# EAGLE schematic ELOB_V1722_Index_B (EAGLE 6.5.0)

## Sheet 1 of 8: Controller
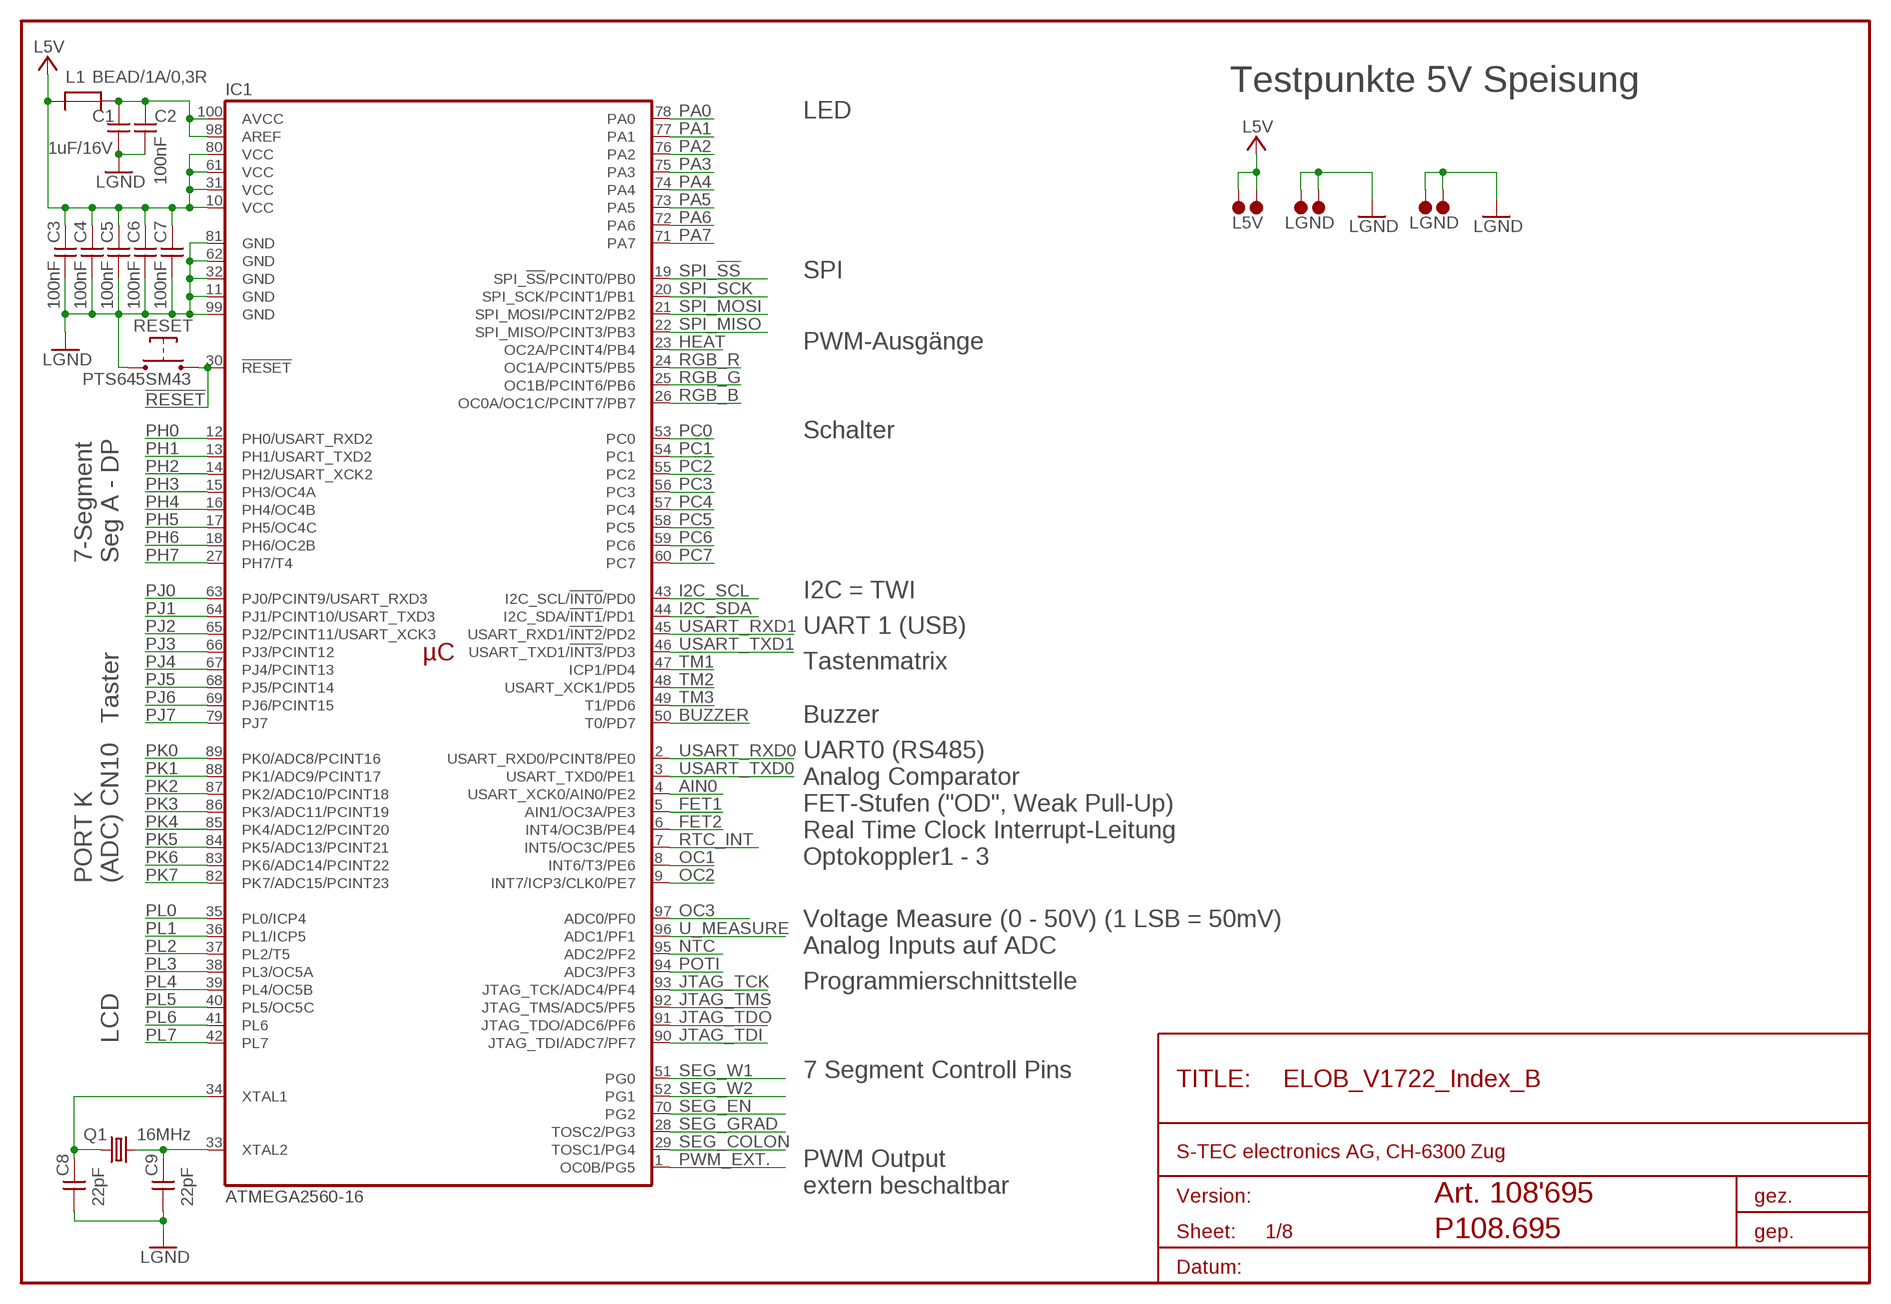
[diagram p0: schematic, sheet 1]

### Parts
.L5V  L5V  TESTPAD_2P_V1_NORESTRICT  [TESTPAD_2P_V1_NORESTRICT]
C1  1uF/16V  C_SMD0603  [C0603]
C2  100nF  C_SMD0603  [C0603]
C3  100nF  C_SMD0603  [C0603]
C4  100nF  C_SMD0603  [C0603]
C5  100nF  C_SMD0603  [C0603]
C6  100nF  C_SMD0603  [C0603]
C7  100nF  C_SMD0603  [C0603]
C8  22pF  C_SMD0603  [C0603]
C9  22pF  C_SMD0603  [C0603]
IC1  ATMEGA2560-16  ATMEGA2560_TQFP100  [TQFP100]
L1  BEAD/1A/0,3R  FERRITE-BEAD_1206  [R1206]
Q1  16MHz  CRYSTALA  [HC49_S]
RESET  PTS645SM43  TASTER_C&K_PTS645_SMD  [DTSM-6]
TP1  LGND  TESTPAD_2P_V1_NORESTRICT  [TESTPAD_2P_V1_NORESTRICT]
TP12  LGND  TESTPAD_2P_V1_NORESTRICT  [TESTPAD_2P_V1_NORESTRICT]

### Nets
!RESET!: IC1.30(!RESET!) RESET.3 RESET.4 ; also sheet 5
AIN0: IC1.4(USART_XCK0/AIN0/PE2) ; also sheet 5
BUZZER: IC1.50(T0/PD7) ; also sheet 6
FET1: IC1.5(AIN1/OC3A/PE3) ; also sheet 4
FET2: IC1.6(INT4/OC3B/PE4) ; also sheet 4
HEAT: IC1.23(OC2A/PCINT4/PB4) ; also sheet 6
I2C_SCL: IC1.43(I2C_SCL/!INT0!/PD0) ; also sheet 5,7
I2C_SDA: IC1.44(I2C_SDA/!INT1!/PD1) ; also sheet 5,7
JTAG_TCK: IC1.93(JTAG_TCK/ADC4/PF4) ; also sheet 5
JTAG_TDI: IC1.90(JTAG_TDI/ADC7/PF7) ; also sheet 5
JTAG_TDO: IC1.91(JTAG_TDO/ADC6/PF6) ; also sheet 5
JTAG_TMS: IC1.92(JTAG_TMS/ADC5/PF5) ; also sheet 5
L5V: .L5V.1 .L5V.2 C3.1 C4.1 C5.1 C6.1 C7.1 IC1.10(VCC) IC1.31(VCC) IC1.61(VCC) IC1.80(VCC) L1.1 ; supply symbol labelled .L5V ; also sheet 2,3,4,5,6,7,8
LGND: C1.2 C2.2 C3.2 C4.2 C5.2 C6.2 C7.2 C8.2 C9.2 IC1.11(GND) IC1.32(GND) IC1.62(GND) IC1.81(GND) IC1.99(GND) RESET.1 RESET.2 TP1.1 TP1.2 TP12.1 TP12.2 ; supply symbol labelled .LGND ; also sheet 2,3,4,5,6,7,8
N$2: C8.1 IC1.34(XTAL1) Q1.1
N$6: C9.1 IC1.33(XTAL2) Q1.2
N$9: C1.1 C2.1 IC1.98(AREF) IC1.100(AVCC) L1.2
NTC: IC1.95(ADC2/PF2) ; also sheet 6
OC1: IC1.8(INT6/T3/PE6) ; also sheet 4
OC2: IC1.9(INT7/ICP3/CLK0/PE7) ; also sheet 4
OC3: IC1.97(ADC0/PF0) ; also sheet 4
PA0: IC1.78(PA0) ; also sheet 2
PA1: IC1.77(PA1) ; also sheet 2
PA2: IC1.76(PA2) ; also sheet 2
PA3: IC1.75(PA3) ; also sheet 2
PA4: IC1.74(PA4) ; also sheet 2
PA5: IC1.73(PA5) ; also sheet 2
PA6: IC1.72(PA6) ; also sheet 2
PA7: IC1.71(PA7) ; also sheet 2
PC0: IC1.53(PC0) ; also sheet 2
PC1: IC1.54(PC1) ; also sheet 2
PC2: IC1.55(PC2) ; also sheet 2
PC3: IC1.56(PC3) ; also sheet 2
PC4: IC1.57(PC4) ; also sheet 2
PC5: IC1.58(PC5) ; also sheet 2
PC6: IC1.59(PC6) ; also sheet 2
PC7: IC1.60(PC7) ; also sheet 2
PH0: IC1.12(PH0/USART_RXD2) ; also sheet 3,5
PH1: IC1.13(PH1/USART_TXD2) ; also sheet 3,5
PH2: IC1.14(PH2/USART_XCK2) ; also sheet 3,5
PH3: IC1.15(PH3/OC4A) ; also sheet 3,5
PH4: IC1.16(PH4/OC4B) ; also sheet 3,5
PH5: IC1.17(PH5/OC4C) ; also sheet 3,5
PH6: IC1.18(PH6/OC2B) ; also sheet 3,5
PH7: IC1.27(PH7/T4) ; also sheet 3,5
PJ0: IC1.63(PJ0/PCINT9/USART_RXD3) ; also sheet 2
PJ1: IC1.64(PJ1/PCINT10/USART_TXD3) ; also sheet 2
PJ2: IC1.65(PJ2/PCINT11/USART_XCK3) ; also sheet 2
PJ3: IC1.66(PJ3/PCINT12) ; also sheet 2
PJ4: IC1.67(PJ4/PCINT13) ; also sheet 2
PJ5: IC1.68(PJ5/PCINT14) ; also sheet 2
PJ6: IC1.69(PJ6/PCINT15) ; also sheet 2
PJ7: IC1.79(PJ7) ; also sheet 2
PK0: IC1.89(PK0/ADC8/PCINT16) ; also sheet 5
PK1: IC1.88(PK1/ADC9/PCINT17) ; also sheet 5
PK2: IC1.87(PK2/ADC10/PCINT18) ; also sheet 5
PK3: IC1.86(PK3/ADC11/PCINT19) ; also sheet 5
PK4: IC1.85(PK4/ADC12/PCINT20) ; also sheet 5
PK5: IC1.84(PK5/ADC13/PCINT21) ; also sheet 5
PK6: IC1.83(PK6/ADC14/PCINT22) ; also sheet 5
PK7: IC1.82(PK7/ADC15/PCINT23) ; also sheet 5
PL0: IC1.35(PL0/ICP4) ; also sheet 7
PL1: IC1.36(PL1/ICP5) ; also sheet 7
PL2: IC1.37(PL2/T5) ; also sheet 7
PL3: IC1.38(PL3/OC5A) ; also sheet 7
PL4: IC1.39(PL4/OC5B) ; also sheet 7
PL5: IC1.40(PL5/OC5C) ; also sheet 7
PL6: IC1.41(PL6) ; also sheet 7
PL7: IC1.42(PL7) ; also sheet 7
POTI: IC1.94(ADC3/PF3) ; also sheet 6
PWM_EXT.: IC1.1(OC0B/PG5) ; also sheet 5
RGB_B: IC1.26(OC0A/OC1C/PCINT7/PB7) ; also sheet 6
RGB_G: IC1.25(OC1B/PCINT6/PB6) ; also sheet 6
RGB_R: IC1.24(OC1A/PCINT5/PB5) ; also sheet 6
RTC_INT: IC1.7(INT5/OC3C/PE5) ; also sheet 7
SEG_COLON: IC1.29(TOSC1/PG4) ; also sheet 3
SEG_EN: IC1.70(PG2) ; also sheet 3
SEG_GRAD: IC1.28(TOSC2/PG3) ; also sheet 3
SEG_W1: IC1.51(PG0) ; also sheet 3
SEG_W2: IC1.52(PG1) ; also sheet 3
SPI_!SS!: IC1.19(SPI_!SS!/PCINT0/PB0) ; also sheet 5
SPI_MISO: IC1.22(SPI_MISO/PCINT3/PB3) ; also sheet 5
SPI_MOSI: IC1.21(SPI_MOSI/PCINT2/PB2) ; also sheet 5
SPI_SCK: IC1.20(SPI_SCK/PCINT1/PB1) ; also sheet 5
TM1: IC1.47(ICP1/PD4) ; also sheet 3
TM2: IC1.48(USART_XCK1/PD5) ; also sheet 3
TM3: IC1.49(T1/PD6) ; also sheet 3
U_MEASURE: IC1.96(ADC1/PF1) ; also sheet 6
USART_RXD0: IC1.2(USART_RXD0/PCINT8/PE0) ; also sheet 7
USART_RXD1: IC1.45(USART_RXD1/!INT2!/PD2) ; also sheet 8
USART_TXD0: IC1.3(USART_TXD0/PE1) ; also sheet 7
USART_TXD1: IC1.46(USART_TXD1/!INT3!/PD3) ; also sheet 8

### Notes on the sheet
- Testpunkte 5V Speisung
- LED
- SPI
- PWM-Ausgänge
- Schalter
- 7-Segment | Seg A - DP
- I2C = TWI
- UART 1 (USB)
- Tastenmatrix
- Taster | Buzzer
- UART0 (RS485)
- Analog Comparator
- FET-Stufen ("OD", Weak Pull-Up)
- Real Time Clock Interrupt-Leitung
- Optokoppler1 - 3
- PORT K
  (ADC) CN10
- Voltage Measure (0 - 50V) (1 LSB = 50mV)
- Analog Inputs auf ADC
- Programmierschnittstelle
- LCD
- 7 Segment Controll Pins
- PWM Output
- extern beschaltbar
- Art. 108'695
- P108.695

## Sheet 2 of 8: Digital I/Os
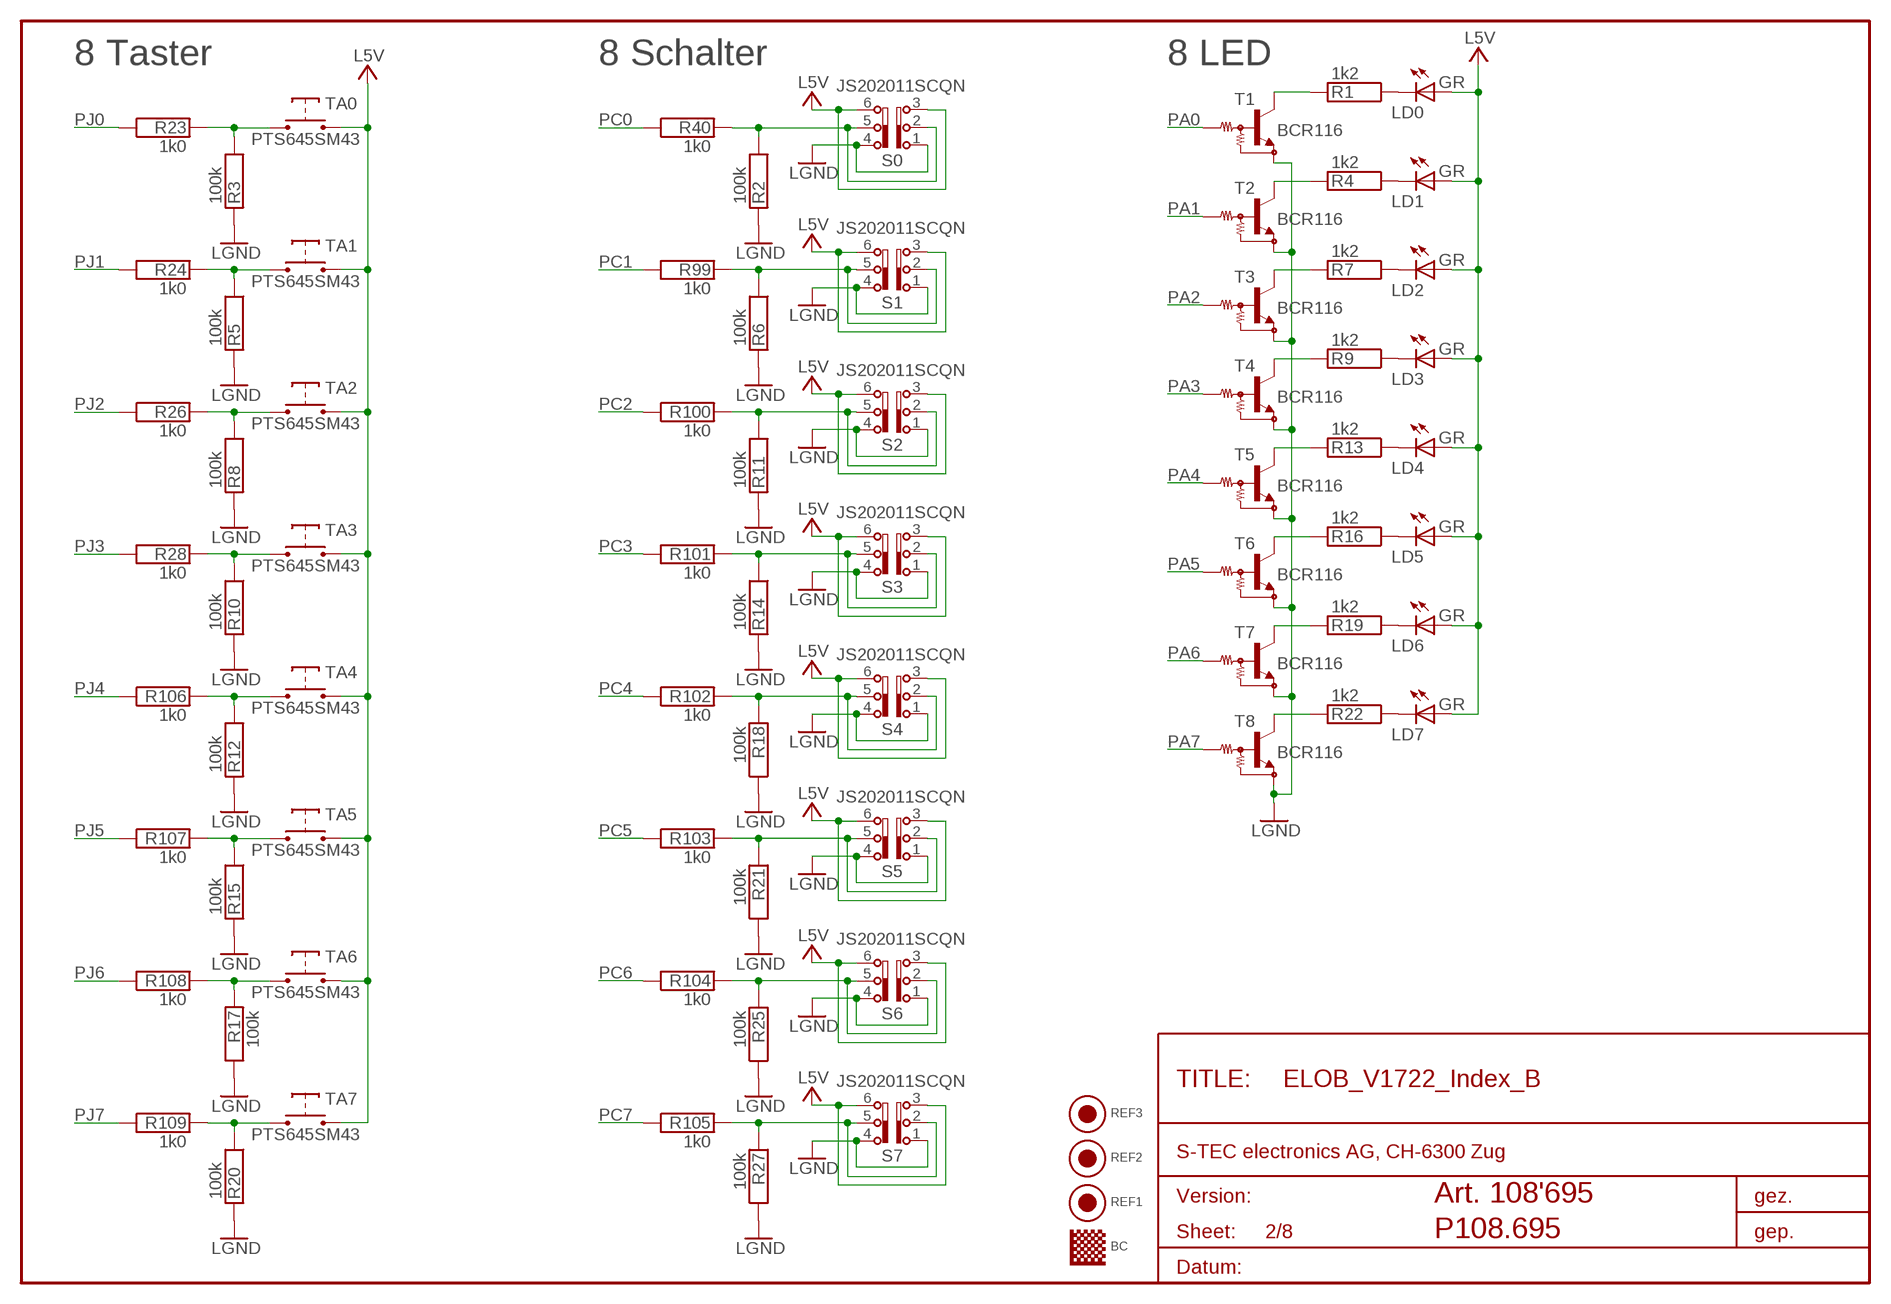
[diagram p1: schematic, sheet 2]

### Parts
BC  BC  BARCODE  [BARCODE]
LD0  GR  LED_0805  [LED_0805]
LD1  GR  LED_0805  [LED_0805]
LD2  GR  LED_0805  [LED_0805]
LD3  GR  LED_0805  [LED_0805]
LD4  GR  LED_0805  [LED_0805]
LD5  GR  LED_0805  [LED_0805]
LD6  GR  LED_0805  [LED_0805]
LD7  GR  LED_0805  [LED_0805]
R1  1k2  R0603  [R0603]
R2  100k  R0603  [R0603]
R3  100k  R0603  [R0603]
R4  1k2  R0603  [R0603]
R5  100k  R0603  [R0603]
R6  100k  R0603  [R0603]
R7  1k2  R0603  [R0603]
R8  100k  R0603  [R0603]
R9  1k2  R0603  [R0603]
R10  100k  R0603  [R0603]
R11  100k  R0603  [R0603]
R12  100k  R0603  [R0603]
R13  1k2  R0603  [R0603]
R14  100k  R0603  [R0603]
R15  100k  R0603  [R0603]
R16  1k2  R0603  [R0603]
R17  100k  R0603  [R0603]
R18  100k  R0603  [R0603]
R19  1k2  R0603  [R0603]
R20  100k  R0603  [R0603]
R21  100k  R0603  [R0603]
R22  1k2  R0603  [R0603]
R23  1k0  R0603  [R0603]
R24  1k0  R0603  [R0603]
R25  100k  R0603  [R0603]
R26  1k0  R0603  [R0603]
R27  100k  R0603  [R0603]
R28  1k0  R0603  [R0603]
R40  1k0  R0603  [R0603]
R99  1k0  R0603  [R0603]
R100  1k0  R0603  [R0603]
R101  1k0  R0603  [R0603]
R102  1k0  R0603  [R0603]
R103  1k0  R0603  [R0603]
R104  1k0  R0603  [R0603]
R105  1k0  R0603  [R0603]
R106  1k0  R0603  [R0603]
R107  1k0  R0603  [R0603]
R108  1k0  R0603  [R0603]
R109  1k0  R0603  [R0603]
REF1  DOT  REF  [PAS_PLACE]
REF2  DOT  REF  [PAS_PLACE]
REF3  DOT  REF  [PAS_PLACE]
S0  JS202011SCQN  [JS202011SCQN]
S1  JS202011SCQN  [JS202011SCQN]
S2  JS202011SCQN  [JS202011SCQN]
S3  JS202011SCQN  [JS202011SCQN]
S4  JS202011SCQN  [JS202011SCQN]
S5  JS202011SCQN  [JS202011SCQN]
S6  JS202011SCQN  [JS202011SCQN]
S7  JS202011SCQN  [JS202011SCQN]
T1  BCR116  TRANSISTOR_NPN_RESISTOR_BCR116  [SOT_23]
T2  BCR116  TRANSISTOR_NPN_RESISTOR_BCR116  [SOT_23]
T3  BCR116  TRANSISTOR_NPN_RESISTOR_BCR116  [SOT_23]
T4  BCR116  TRANSISTOR_NPN_RESISTOR_BCR116  [SOT_23]
T5  BCR116  TRANSISTOR_NPN_RESISTOR_BCR116  [SOT_23]
T6  BCR116  TRANSISTOR_NPN_RESISTOR_BCR116  [SOT_23]
T7  BCR116  TRANSISTOR_NPN_RESISTOR_BCR116  [SOT_23]
T8  BCR116  TRANSISTOR_NPN_RESISTOR_BCR116  [SOT_23]
TA0  PTS645SM43  TASTER_C&K_PTS645_SMD  [DTSM-6]
TA1  PTS645SM43  TASTER_C&K_PTS645_SMD  [DTSM-6]
TA2  PTS645SM43  TASTER_C&K_PTS645_SMD  [DTSM-6]
TA3  PTS645SM43  TASTER_C&K_PTS645_SMD  [DTSM-6]
TA4  PTS645SM43  TASTER_C&K_PTS645_SMD  [DTSM-6]
TA5  PTS645SM43  TASTER_C&K_PTS645_SMD  [DTSM-6]
TA6  PTS645SM43  TASTER_C&K_PTS645_SMD  [DTSM-6]
TA7  PTS645SM43  TASTER_C&K_PTS645_SMD  [DTSM-6]

### Nets
L5V: LD0.A LD1.A LD2.A LD3.A LD4.A LD5.A LD6.A LD7.A S0.3 S0.6 S1.3 S1.6 S2.3 S2.6 S3.3 S3.6 S4.3 S4.6 S5.3 S5.6 S6.3 S6.6 S7.3 S7.6 TA0.1 TA0.2 TA1.1 TA1.2 TA2.1 TA2.2 TA3.1 TA3.2 TA4.1 TA4.2 TA5.1 TA5.2 TA6.1 TA6.2 TA7.1 TA7.2 ; supply symbol labelled .L5V ; also sheet 1,3,4,5,6,7,8
LGND: R2.1 R3.1 R5.1 R6.1 R8.1 R10.1 R11.1 R12.1 R14.1 R15.1 R17.2 R18.2 R20.1 R21.2 R25.2 R27.2 S0.1 S0.4 S1.1 S1.4 S2.1 S2.4 S3.1 S3.4 S4.1 S4.4 S5.1 S5.4 S6.1 S6.4 S7.1 S7.4 T1.2(E) T2.2(E) T3.2(E) T4.2(E) T5.2(E) T6.2(E) T7.2(E) T8.2(E) ; supply symbol labelled .LGND ; also sheet 1,3,4,5,6,7,8
N$1: R1.1 T1.3(C)
N$3: LD1.K(C) R4.2
N$8: LD0.K(C) R1.2
N$10: LD2.K(C) R7.2
N$16: LD3.K(C) R9.2
N$17: LD4.K(C) R13.2
N$18: LD5.K(C) R16.2
N$19: LD6.K(C) R19.2
N$20: LD7.K(C) R22.2
N$21: R4.1 T2.3(C)
N$22: R7.1 T3.3(C)
N$23: R9.1 T4.3(C)
N$24: R13.1 T5.3(C)
N$25: R16.1 T6.3(C)
N$26: R19.1 T7.3(C)
N$27: R22.1 T8.3(C)
N$105: R2.2 R40.1 S0.2 S0.5
N$106: R20.2 R109.1 TA7.3 TA7.4
N$107: R27.1 R105.1 S7.2 S7.5
N$108: R17.1 R108.1 TA6.3 TA6.4
N$109: R15.2 R107.1 TA5.3 TA5.4
N$110: R12.2 R106.1 TA4.3 TA4.4
N$112: R25.1 R104.1 S6.2 S6.5
N$113: R10.2 R28.1 TA3.3 TA3.4
N$114: R6.2 R99.1 S1.2 S1.5
N$115: R8.2 R26.1 TA2.3 TA2.4
N$116: R21.1 R103.1 S5.2 S5.5
N$117: R18.1 R102.1 S4.2 S4.5
N$118: R14.2 R101.1 S3.2 S3.5
N$119: R11.2 R100.1 S2.2 S2.5
N$120: R5.2 R24.1 TA1.3 TA1.4
N$121: R3.2 R23.1 TA0.3 TA0.4
PA0: T1.1(B) ; also sheet 1
PA1: T2.1(B) ; also sheet 1
PA2: T3.1(B) ; also sheet 1
PA3: T4.1(B) ; also sheet 1
PA4: T5.1(B) ; also sheet 1
PA5: T6.1(B) ; also sheet 1
PA6: T7.1(B) ; also sheet 1
PA7: T8.1(B) ; also sheet 1
PC0: R40.2 ; also sheet 1
PC1: R99.2 ; also sheet 1
PC2: R100.2 ; also sheet 1
PC3: R101.2 ; also sheet 1
PC4: R102.2 ; also sheet 1
PC5: R103.2 ; also sheet 1
PC6: R104.2 ; also sheet 1
PC7: R105.2 ; also sheet 1
PJ0: R23.2 ; also sheet 1
PJ1: R24.2 ; also sheet 1
PJ2: R26.2 ; also sheet 1
PJ3: R28.2 ; also sheet 1
PJ4: R106.2 ; also sheet 1
PJ5: R107.2 ; also sheet 1
PJ6: R108.2 ; also sheet 1
PJ7: R109.2 ; also sheet 1

### Notes on the sheet
- 8 Taster | 8 Schalter | 8 LED
- Art. 108'695
- P108.695

## Sheet 3 of 8: Multiplex
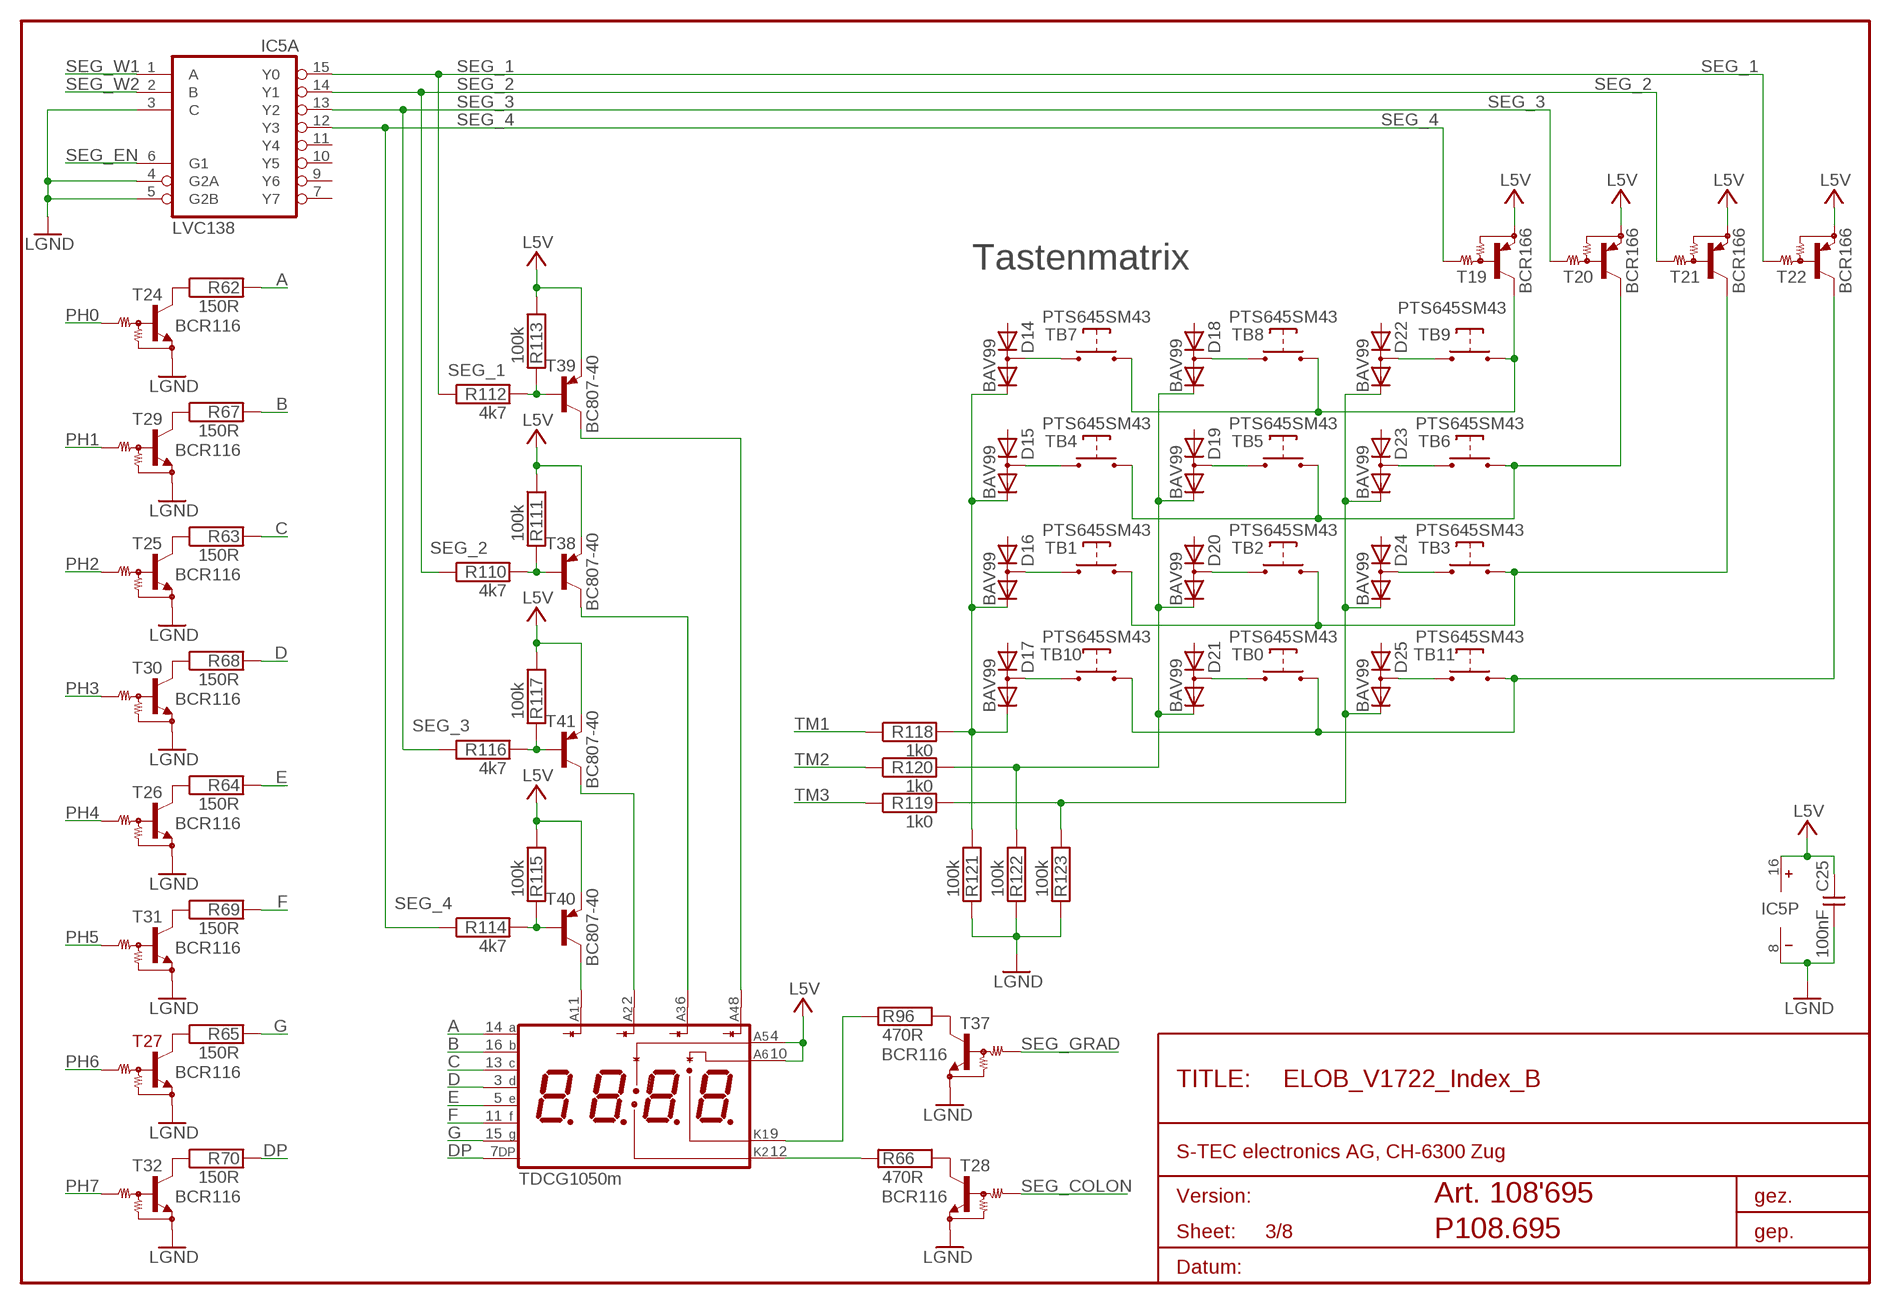
[diagram p2: schematic, sheet 3]

### Parts
C25  100nF  C_SMD0603  [C0603]
D14  BAV99  DIODE_DUAL_CAC_BAV99  [SOT_23]
D15  BAV99  DIODE_DUAL_CAC_BAV99  [SOT_23]
D16  BAV99  DIODE_DUAL_CAC_BAV99  [SOT_23]
D17  BAV99  DIODE_DUAL_CAC_BAV99  [SOT_23]
D18  BAV99  DIODE_DUAL_CAC_BAV99  [SOT_23]
D19  BAV99  DIODE_DUAL_CAC_BAV99  [SOT_23]
D20  BAV99  DIODE_DUAL_CAC_BAV99  [SOT_23]
D21  BAV99  DIODE_DUAL_CAC_BAV99  [SOT_23]
D22  BAV99  DIODE_DUAL_CAC_BAV99  [SOT_23]
D23  BAV99  DIODE_DUAL_CAC_BAV99  [SOT_23]
D24  BAV99  DIODE_DUAL_CAC_BAV99  [SOT_23]
D25  BAV99  DIODE_DUAL_CAC_BAV99  [SOT_23]
IC5  LVC138  IC_74LVC138_TSSOP16  [TSSOP_16]
R62  150R  R0603  [R0603]
R63  150R  R0603  [R0603]
R64  150R  R0603  [R0603]
R65  150R  R0603  [R0603]
R66  470R  R0603  [R0603]
R67  150R  R0603  [R0603]
R68  150R  R0603  [R0603]
R69  150R  R0603  [R0603]
R70  150R  R0603  [R0603]
R96  470R  R0603  [R0603]
R110  4k7  R0603  [R0603]
R111  100k  R0603  [R0603]
R112  4k7  R0603  [R0603]
R113  100k  R0603  [R0603]
R114  4k7  R0603  [R0603]
R115  100k  R0603  [R0603]
R116  4k7  R0603  [R0603]
R117  100k  R0603  [R0603]
R118  1k0  R0603  [R0603]
R119  1k0  R0603  [R0603]
R120  1k0  R0603  [R0603]
R121  100k  R0603  [R0603]
R122  100k  R0603  [R0603]
R123  100k  R0603  [R0603]
SEG1  TDCG1050m  4-FACH_7-SEGMENT  [4-FACH_7-SEGMENT]
T19  BCR166  TRANSISTOR_PNP_RESISTOR_BCR166  [SOT_23]
T20  BCR166  TRANSISTOR_PNP_RESISTOR_BCR166  [SOT_23]
T21  BCR166  TRANSISTOR_PNP_RESISTOR_BCR166  [SOT_23]
T22  BCR166  TRANSISTOR_PNP_RESISTOR_BCR166  [SOT_23]
T24  BCR116  TRANSISTOR_NPN_RESISTOR_BCR116  [SOT_23]
T25  BCR116  TRANSISTOR_NPN_RESISTOR_BCR116  [SOT_23]
T26  BCR116  TRANSISTOR_NPN_RESISTOR_BCR116  [SOT_23]
T27  BCR116  TRANSISTOR_NPN_RESISTOR_BCR116  [SOT_23]
T28  BCR116  TRANSISTOR_NPN_RESISTOR_BCR116  [SOT_23]
T29  BCR116  TRANSISTOR_NPN_RESISTOR_BCR116  [SOT_23]
T30  BCR116  TRANSISTOR_NPN_RESISTOR_BCR116  [SOT_23]
T31  BCR116  TRANSISTOR_NPN_RESISTOR_BCR116  [SOT_23]
T32  BCR116  TRANSISTOR_NPN_RESISTOR_BCR116  [SOT_23]
T37  BCR116  TRANSISTOR_NPN_RESISTOR_BCR116  [SOT_23]
T38  BC807-40  TRANSISTOR_PNP_BC807  [SOT23]
T39  BC807-40  TRANSISTOR_PNP_BC807  [SOT23]
T40  BC807-40  TRANSISTOR_PNP_BC807  [SOT23]
T41  BC807-40  TRANSISTOR_PNP_BC807  [SOT23]
TB0  PTS645SM43  TASTER_C&K_PTS645_SMD  [DTSM-6]
TB1  PTS645SM43  TASTER_C&K_PTS645_SMD  [DTSM-6]
TB2  PTS645SM43  TASTER_C&K_PTS645_SMD  [DTSM-6]
TB3  PTS645SM43  TASTER_C&K_PTS645_SMD  [DTSM-6]
TB4  PTS645SM43  TASTER_C&K_PTS645_SMD  [DTSM-6]
TB5  PTS645SM43  TASTER_C&K_PTS645_SMD  [DTSM-6]
TB6  PTS645SM43  TASTER_C&K_PTS645_SMD  [DTSM-6]
TB7  PTS645SM43  TASTER_C&K_PTS645_SMD  [DTSM-6]
TB8  PTS645SM43  TASTER_C&K_PTS645_SMD  [DTSM-6]
TB9  PTS645SM43  TASTER_C&K_PTS645_SMD  [DTSM-6]
TB10  PTS645SM43  TASTER_C&K_PTS645_SMD  [DTSM-6]
TB11  PTS645SM43  TASTER_C&K_PTS645_SMD  [DTSM-6]

### Nets
A: R62.1 SEG1.14(A)
B: R67.1 SEG1.16(B)
C: R63.1 SEG1.13(C)
D: R68.1 SEG1.3(D)
DP: R70.1 SEG1.7(DP)
E: R64.1 SEG1.5(E)
F: R69.1 SEG1.11(F)
G: R65.1 SEG1.15(G)
L5V: C25.1 IC5.16(P:VCC) R111.2 R113.2 R115.2 R117.2 SEG1.4(A) SEG1.10(A) T19.2(E) T20.2(E) T21.2(E) T22.2(E) T38.2(E) T39.2(E) T40.2(E) T41.2(E) ; supply symbol labelled .L5V ; also sheet 1,2,4,5,6,7,8
LGND: C25.2 IC5.3(A:C) IC5.4(A:G2A) IC5.5(A:G2B) IC5.8(P:GND) R121.1 R122.1 R123.1 T24.2(E) T25.2(E) T26.2(E) T27.2(E) T28.2(E) T29.2(E) T30.2(E) T31.2(E) T32.2(E) T37.2(E) ; supply symbol labelled .LGND ; also sheet 1,2,4,5,6,7,8
N$29: T19.3(C) TB7.3 TB7.4 TB8.3 TB8.4 TB9.3 TB9.4
N$30: R66.2 T28.3(C)
N$32: R66.1 SEG1.12(K2)
N$47: R62.2 T24.3(C)
N$50: R67.2 T29.3(C)
N$51: T22.3(C) TB0.3 TB0.4 TB10.3 TB10.4 TB11.3 TB11.4
N$52: T21.3(C) TB1.3 TB1.4 TB2.3 TB2.4 TB3.3 TB3.4
N$53: D14.3(AC) TB7.1 TB7.2
N$54: R63.2 T25.3(C)
N$55: R68.2 T30.3(C)
N$56: R64.2 T26.3(C)
N$57: R69.2 T31.3(C)
N$58: R65.2 T27.3(C)
N$59: R70.2 T32.3(C)
N$74: R96.2 T37.3(C)
N$104: R96.1 SEG1.9(K1)
N$122: R110.1 R111.1 T38.1(B)
N$123: R114.1 R115.1 T40.1(B)
N$124: R112.1 R113.1 T39.1(B)
N$125: R116.1 R117.1 T41.1(B)
N$126: SEG1.1(A) T40.3(C)
N$127: SEG1.2(A) T41.3(C)
N$128: SEG1.6(A) T38.3(C)
N$129: SEG1.8(A) T39.3(C)
N$130: D15.3(AC) TB4.1 TB4.2
N$131: T20.3(C) TB4.3 TB4.4 TB5.3 TB5.4 TB6.3 TB6.4
N$132: D16.3(AC) TB1.1 TB1.2
N$133: D17.3(AC) TB10.1 TB10.2
N$134: D22.2(C) D23.2(C) D24.2(C) D25.2(C) R119.1 R123.2
N$135: D25.3(AC) TB11.1 TB11.2
N$136: D14.2(C) D15.2(C) D16.2(C) D17.2(C) R118.1 R121.2
N$137: D18.3(AC) TB8.1 TB8.2
N$138: D19.3(AC) TB5.1 TB5.2
N$139: D20.3(AC) TB2.1 TB2.2
N$140: D21.3(AC) TB0.1 TB0.2
N$141: D18.2(C) D19.2(C) D20.2(C) D21.2(C) R120.1 R122.2
N$142: D22.3(AC) TB9.1 TB9.2
N$143: D23.3(AC) TB6.1 TB6.2
N$144: D24.3(AC) TB3.1 TB3.2
PH0: T24.1(B) ; also sheet 1,5
PH1: T29.1(B) ; also sheet 1,5
PH2: T25.1(B) ; also sheet 1,5
PH3: T30.1(B) ; also sheet 1,5
PH4: T26.1(B) ; also sheet 1,5
PH5: T31.1(B) ; also sheet 1,5
PH6: T27.1(B) ; also sheet 1,5
PH7: T32.1(B) ; also sheet 1,5
SEG_1: IC5.15(A:Y0) R112.2 T22.1(B)
SEG_2: IC5.14(A:Y1) R110.2 T21.1(B)
SEG_3: IC5.13(A:Y2) R116.2 T20.1(B)
SEG_4: IC5.12(A:Y3) R114.2 T19.1(B)
SEG_COLON: T28.1(B) ; also sheet 1
SEG_EN: IC5.6(A:G1) ; also sheet 1
SEG_GRAD: T37.1(B) ; also sheet 1
SEG_W1: IC5.1(A:A) ; also sheet 1
SEG_W2: IC5.2(A:B) ; also sheet 1
TM1: R118.2 ; also sheet 1
TM2: R120.2 ; also sheet 1
TM3: R119.2 ; also sheet 1
Unconnected: D14.1(A) D15.1(A) D16.1(A) D17.1(A) D18.1(A) D19.1(A) D20.1(A) D21.1(A) D22.1(A) D23.1(A) D24.1(A) D25.1(A) IC5.7(A:Y7) IC5.9(A:Y6) IC5.10(A:Y5) IC5.11(A:Y4)

### Notes on the sheet
- Tastenmatrix
- Art. 108'695
- P108.695

## Sheet 4 of 8: Inputs & Outputs
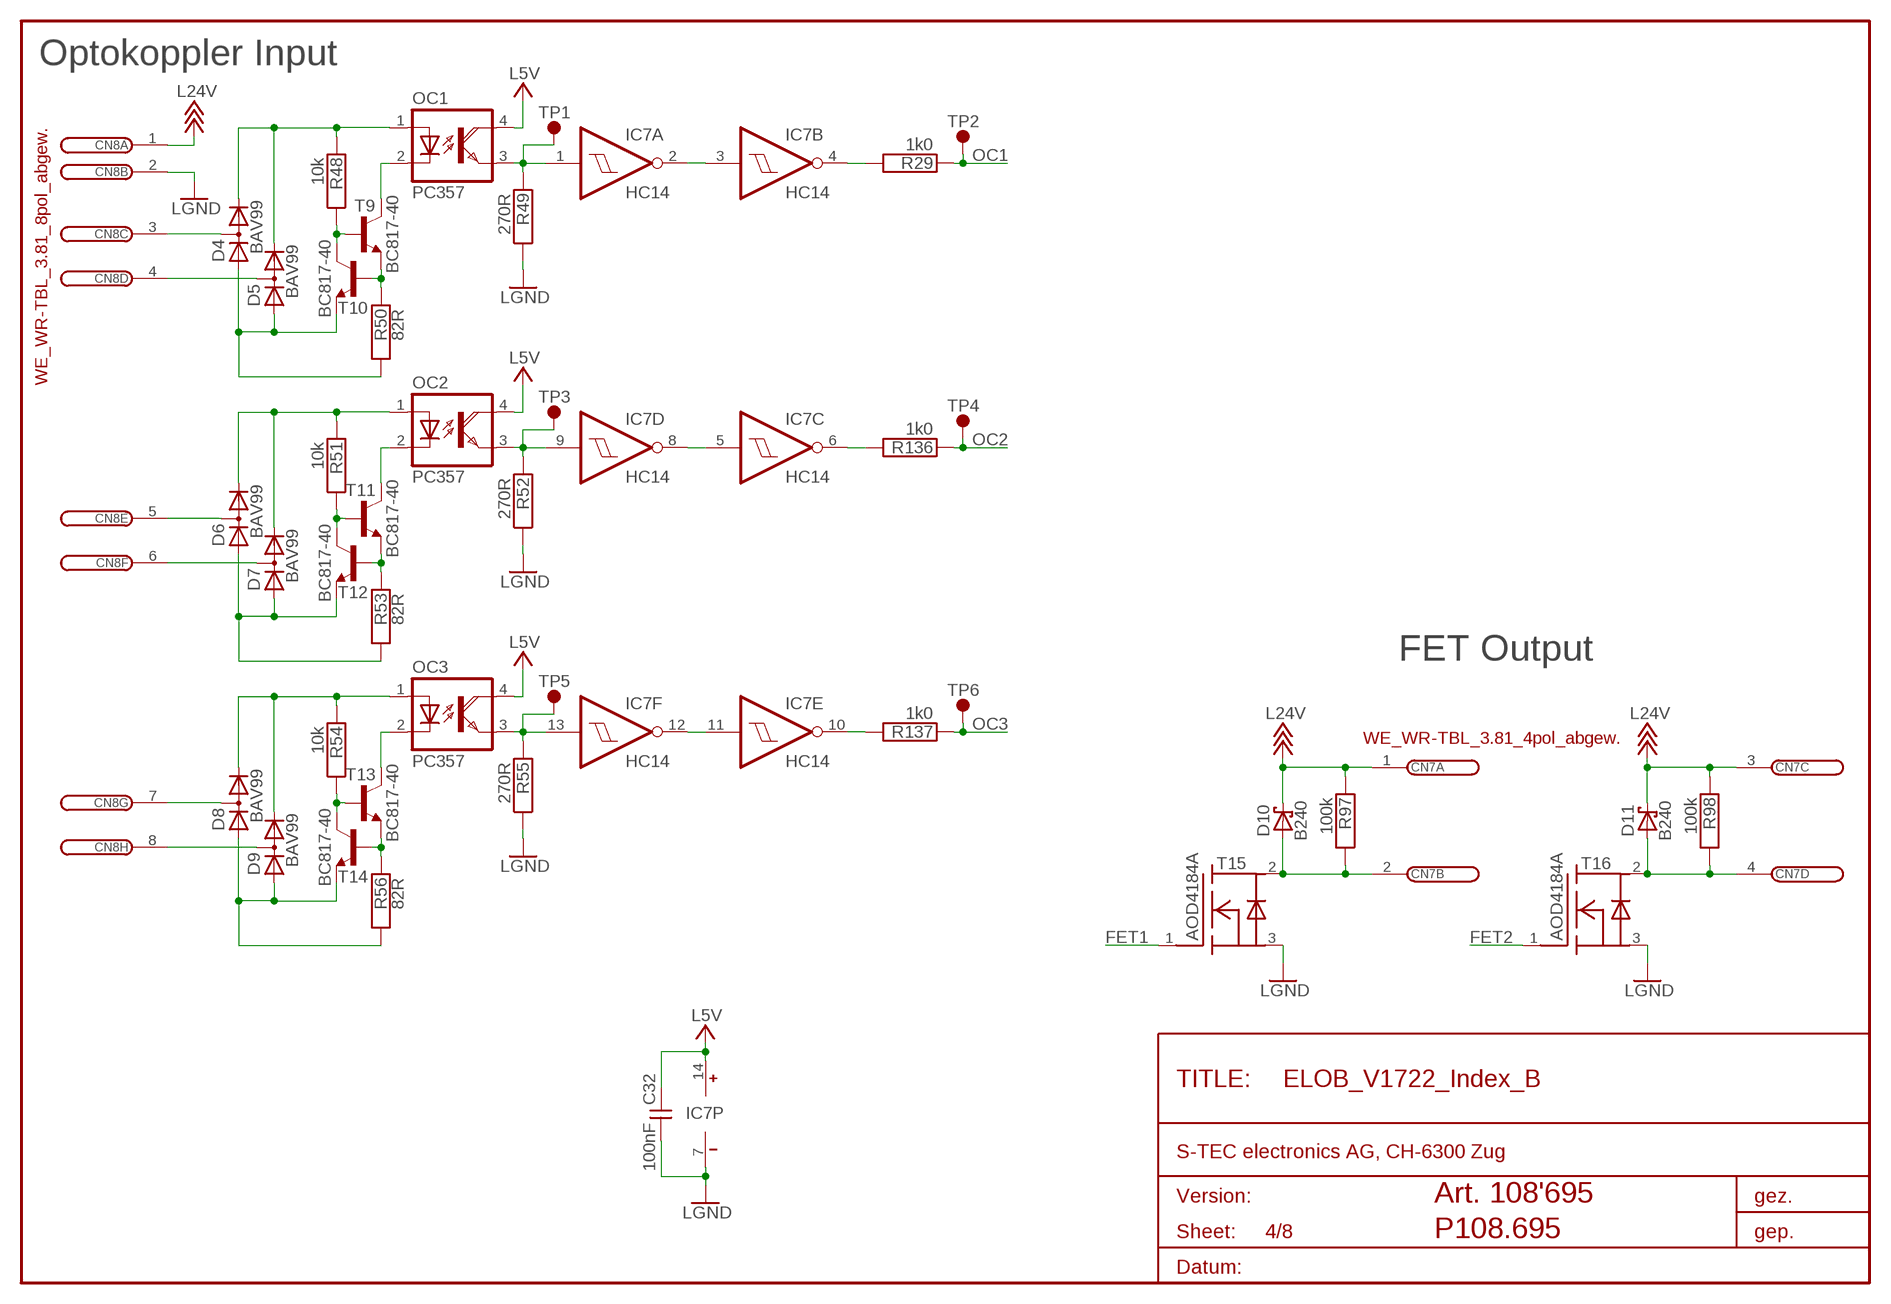
[diagram p3: schematic, sheet 4]

### Parts
C32  100nF  C_SMD0603  [C0603]
CN7  WE_WR-TBL_3.81_4pol_abgew.  CONNECTOR_4-POL_WE_WR-TBL_3,81MM_A  [PHOENIX_G381_4]
CN8  WE_WR-TBL_3.81_8pol_abgew.  CONNECTOR_8-POL_WE_WR-TBL_3,81MM_A  [PHOENIX_G381_8]
D4  BAV99  DIODE_DUAL_CAC_BAV99  [SOT_23]
D5  BAV99  DIODE_DUAL_CAC_BAV99  [SOT_23]
D6  BAV99  DIODE_DUAL_CAC_BAV99  [SOT_23]
D7  BAV99  DIODE_DUAL_CAC_BAV99  [SOT_23]
D8  BAV99  DIODE_DUAL_CAC_BAV99  [SOT_23]
D9  BAV99  DIODE_DUAL_CAC_BAV99  [SOT_23]
D10  B240  DIODE_SCHOTTKY_SMA  [SMA]
D11  B240  DIODE_SCHOTTKY_SMA  [SMA]
IC7  HC14  IC_74HC14_TSSOP14  [TSSOP_14]
OC1  PC357  OPTOCOUPLER_PC357  [SOP_4]
OC2  PC357  OPTOCOUPLER_PC357  [SOP_4]
OC3  PC357  OPTOCOUPLER_PC357  [SOP_4]
R29  1k0  R0603  [R0603]
R48  10k  R0603  [R0603]
R49  270R  R0603  [R0603]
R50  82R  R0603  [R0603]
R51  10k  R0603  [R0603]
R52  270R  R0603  [R0603]
R53  82R  R0603  [R0603]
R54  10k  R0603  [R0603]
R55  270R  R0603  [R0603]
R56  82R  R0603  [R0603]
R97  100k  R0603  [R0603]
R98  100k  R0603  [R0603]
R136  1k0  R0603  [R0603]
R137  1k0  R0603  [R0603]
T9  BC817-40  TRANSISTOR_NPN_BC817  [SOT23-BEC]
T10  BC817-40  TRANSISTOR_NPN_BC817  [SOT23-BEC]
T11  BC817-40  TRANSISTOR_NPN_BC817  [SOT23-BEC]
T12  BC817-40  TRANSISTOR_NPN_BC817  [SOT23-BEC]
T13  BC817-40  TRANSISTOR_NPN_BC817  [SOT23-BEC]
T14  BC817-40  TRANSISTOR_NPN_BC817  [SOT23-BEC]
T15  AOD4184A  FET_N-CHANNEL_AOD4184A  [DPAK]
T16  AOD4184A  FET_N-CHANNEL_AOD4184A  [DPAK]
TP4  TP2  TESTPAD_1P_1MM  [ANSCHLUSSPAD_1MM]
TP7  TP4  TESTPAD_1P_1MM  [ANSCHLUSSPAD_1MM]
TP8  TP6  TESTPAD_1P_1MM  [ANSCHLUSSPAD_1MM]
TP9  TP5  TESTPAD_1P_1MM  [ANSCHLUSSPAD_1MM]
TP10  TP3  TESTPAD_1P_1MM  [ANSCHLUSSPAD_1MM]
TP11  TP1  TESTPAD_1P_1MM  [ANSCHLUSSPAD_1MM]

### Nets
FET1: T15.1(G) ; also sheet 1
FET2: T16.1(G) ; also sheet 1
L5V: C32.1 IC7.14(P:VCC) OC1.4(COL) OC2.4(COL) OC3.4(COL) ; supply symbol labelled .L5V ; also sheet 1,2,3,5,6,7,8
L24V: CN7.1 CN7.3 CN8.1 D10.C D11.C R97.1 R98.1 ; supply symbol labelled .L24V ; also sheet 6,7,8
LGND: C32.2 CN8.2 IC7.7(P:GND) R49.2 R52.2 R55.2 T15.3(S) T16.3(S) ; supply symbol labelled .LGND ; also sheet 1,2,3,5,6,7,8
N$65: D4.2(C) D5.2(C) OC1.1(A) R48.1
N$67: CN8.4 D5.3(AC)
N$68: CN8.3 D4.3(AC)
N$70: R48.2 T9.1(B) T10.3(C)
N$71: OC1.2(C) T9.3(C)
N$72: R50.1 T9.2(E) T10.1(B)
N$73: D4.1(A) D5.1(A) R50.2 T10.2(E)
N$75: D6.2(C) D7.2(C) OC2.1(A) R51.1
N$76: CN8.6 D7.3(AC)
N$77: CN8.5 D6.3(AC)
N$81: R51.2 T11.1(B) T12.3(C)
N$82: OC2.2(C) T11.3(C)
N$83: R53.1 T11.2(E) T12.1(B)
N$84: D6.1(A) D7.1(A) R53.2 T12.2(E)
N$94: D8.2(C) D9.2(C) OC3.1(A) R54.1
N$95: CN8.8 D9.3(AC)
N$96: CN8.7 D8.3(AC)
N$97: R54.2 T13.1(B) T14.3(C)
N$98: OC3.2(C) T13.3(C)
N$99: R56.1 T13.2(E) T14.1(B)
N$100: D8.1(A) D9.1(A) R56.2 T14.2(E)
N$102: CN7.2 D10.A R97.2 T15.2(D)
N$103: CN7.4 D11.A R98.2 T16.2(D)
N$152: IC7.5(C:I) IC7.8(D:O)
N$158: IC7.11(E:I) IC7.12(F:O)
N$159: IC7.2(A:O) IC7.3(B:I)
N$161: IC7.13(F:I) OC3.3(EMI) R55.1 TP9.1
N$162: IC7.9(D:I) OC2.3(EMI) R52.1 TP10.1
N$163: IC7.1(A:I) OC1.3(EMI) R49.1 TP11.1
N$164: IC7.10(E:O) R137.2
N$165: IC7.6(C:O) R136.2
N$167: IC7.4(B:O) R29.2
OC1: R29.1 TP4.1 ; also sheet 1
OC2: R136.1 TP7.1 ; also sheet 1
OC3: R137.1 TP8.1 ; also sheet 1

### Notes on the sheet
- Optokoppler Input
- FET Output
- Art. 108'695
- P108.695

## Sheet 5 of 8
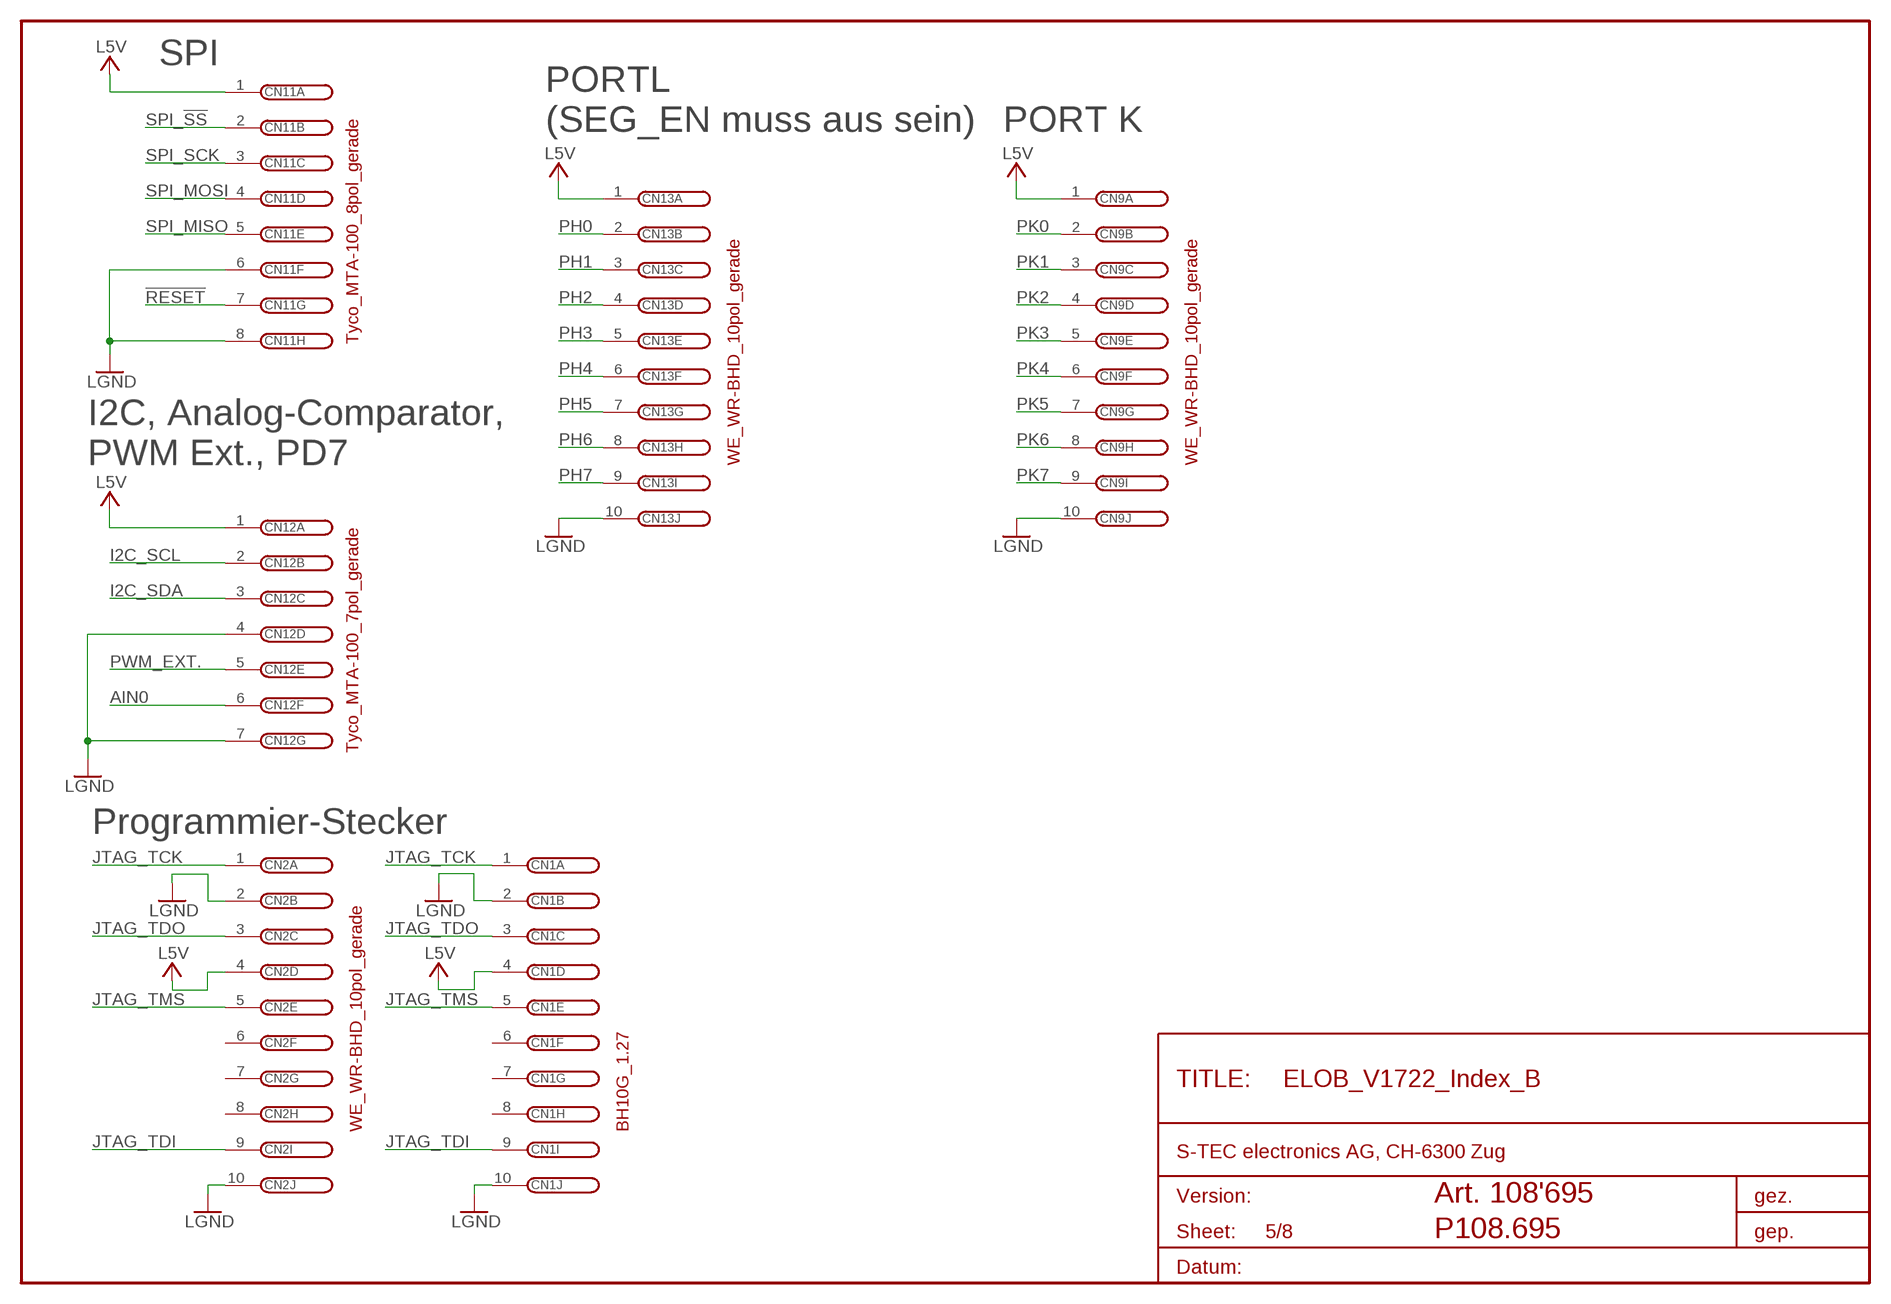
[diagram p4: schematic, sheet 5]

### Parts
CN1  BH10G_1.27  CONNECTOR_10POL  [BH10G_1.27]
CN2  WE_WR-BHD_10pol_gerade  CONNECTOR_10-POL_WE_WR-BHD_G  [BH_10G]
CN9  WE_WR-BHD_10pol_gerade  CONNECTOR_10-POL_WE_WR-BHD_G  [BH_10G]
CN11  Tyco_MTA-100_8pol_gerade  CONNECTOR_8-POL_TYCO_MTA-100_G  [TYCO_MTA-100_8G]
CN12  Tyco_MTA-100_7pol_gerade  CONNECTOR_7-POL_TYCO_MTA-100_G  [TYCO_MTA-100_7G]
CN13  WE_WR-BHD_10pol_gerade  CONNECTOR_10-POL_WE_WR-BHD_G  [BH_10G]

### Nets
!RESET!: CN11.7 ; also sheet 1
AIN0: CN12.6 ; also sheet 1
I2C_SCL: CN12.2 ; also sheet 1,7
I2C_SDA: CN12.3 ; also sheet 1,7
JTAG_TCK: CN1.1 CN2.1 ; also sheet 1
JTAG_TDI: CN1.9 CN2.9 ; also sheet 1
JTAG_TDO: CN1.3 CN2.3 ; also sheet 1
JTAG_TMS: CN1.5 CN2.5 ; also sheet 1
L5V: CN1.4 CN2.4 CN9.1 CN11.1 CN12.1 CN13.1 ; supply symbol labelled .L5V ; also sheet 1,2,3,4,6,7,8
LGND: CN1.2 CN1.10 CN2.2 CN2.10 CN9.10 CN11.6 CN11.8 CN12.4 CN12.7 CN13.10 ; supply symbol labelled .LGND ; also sheet 1,2,3,4,6,7,8
PH0: CN13.2 ; also sheet 1,3
PH1: CN13.3 ; also sheet 1,3
PH2: CN13.4 ; also sheet 1,3
PH3: CN13.5 ; also sheet 1,3
PH4: CN13.6 ; also sheet 1,3
PH5: CN13.7 ; also sheet 1,3
PH6: CN13.8 ; also sheet 1,3
PH7: CN13.9 ; also sheet 1,3
PK0: CN9.2 ; also sheet 1
PK1: CN9.3 ; also sheet 1
PK2: CN9.4 ; also sheet 1
PK3: CN9.5 ; also sheet 1
PK4: CN9.6 ; also sheet 1
PK5: CN9.7 ; also sheet 1
PK6: CN9.8 ; also sheet 1
PK7: CN9.9 ; also sheet 1
PWM_EXT.: CN12.5 ; also sheet 1
SPI_!SS!: CN11.2 ; also sheet 1
SPI_MISO: CN11.5 ; also sheet 1
SPI_MOSI: CN11.4 ; also sheet 1
SPI_SCK: CN11.3 ; also sheet 1
Unconnected: CN1.6 CN1.7 CN1.8 CN2.6 CN2.7 CN2.8

### Notes on the sheet
- SPI
- PORTL
  (SEG_EN muss aus sein)
- PORT K
- I2C, Analog-Comparator,
  PWM Ext., PD7
- Programmier-Stecker
- Art. 108'695
- P108.695

## Sheet 6 of 8: PWM-Controlled & ADC Inputs
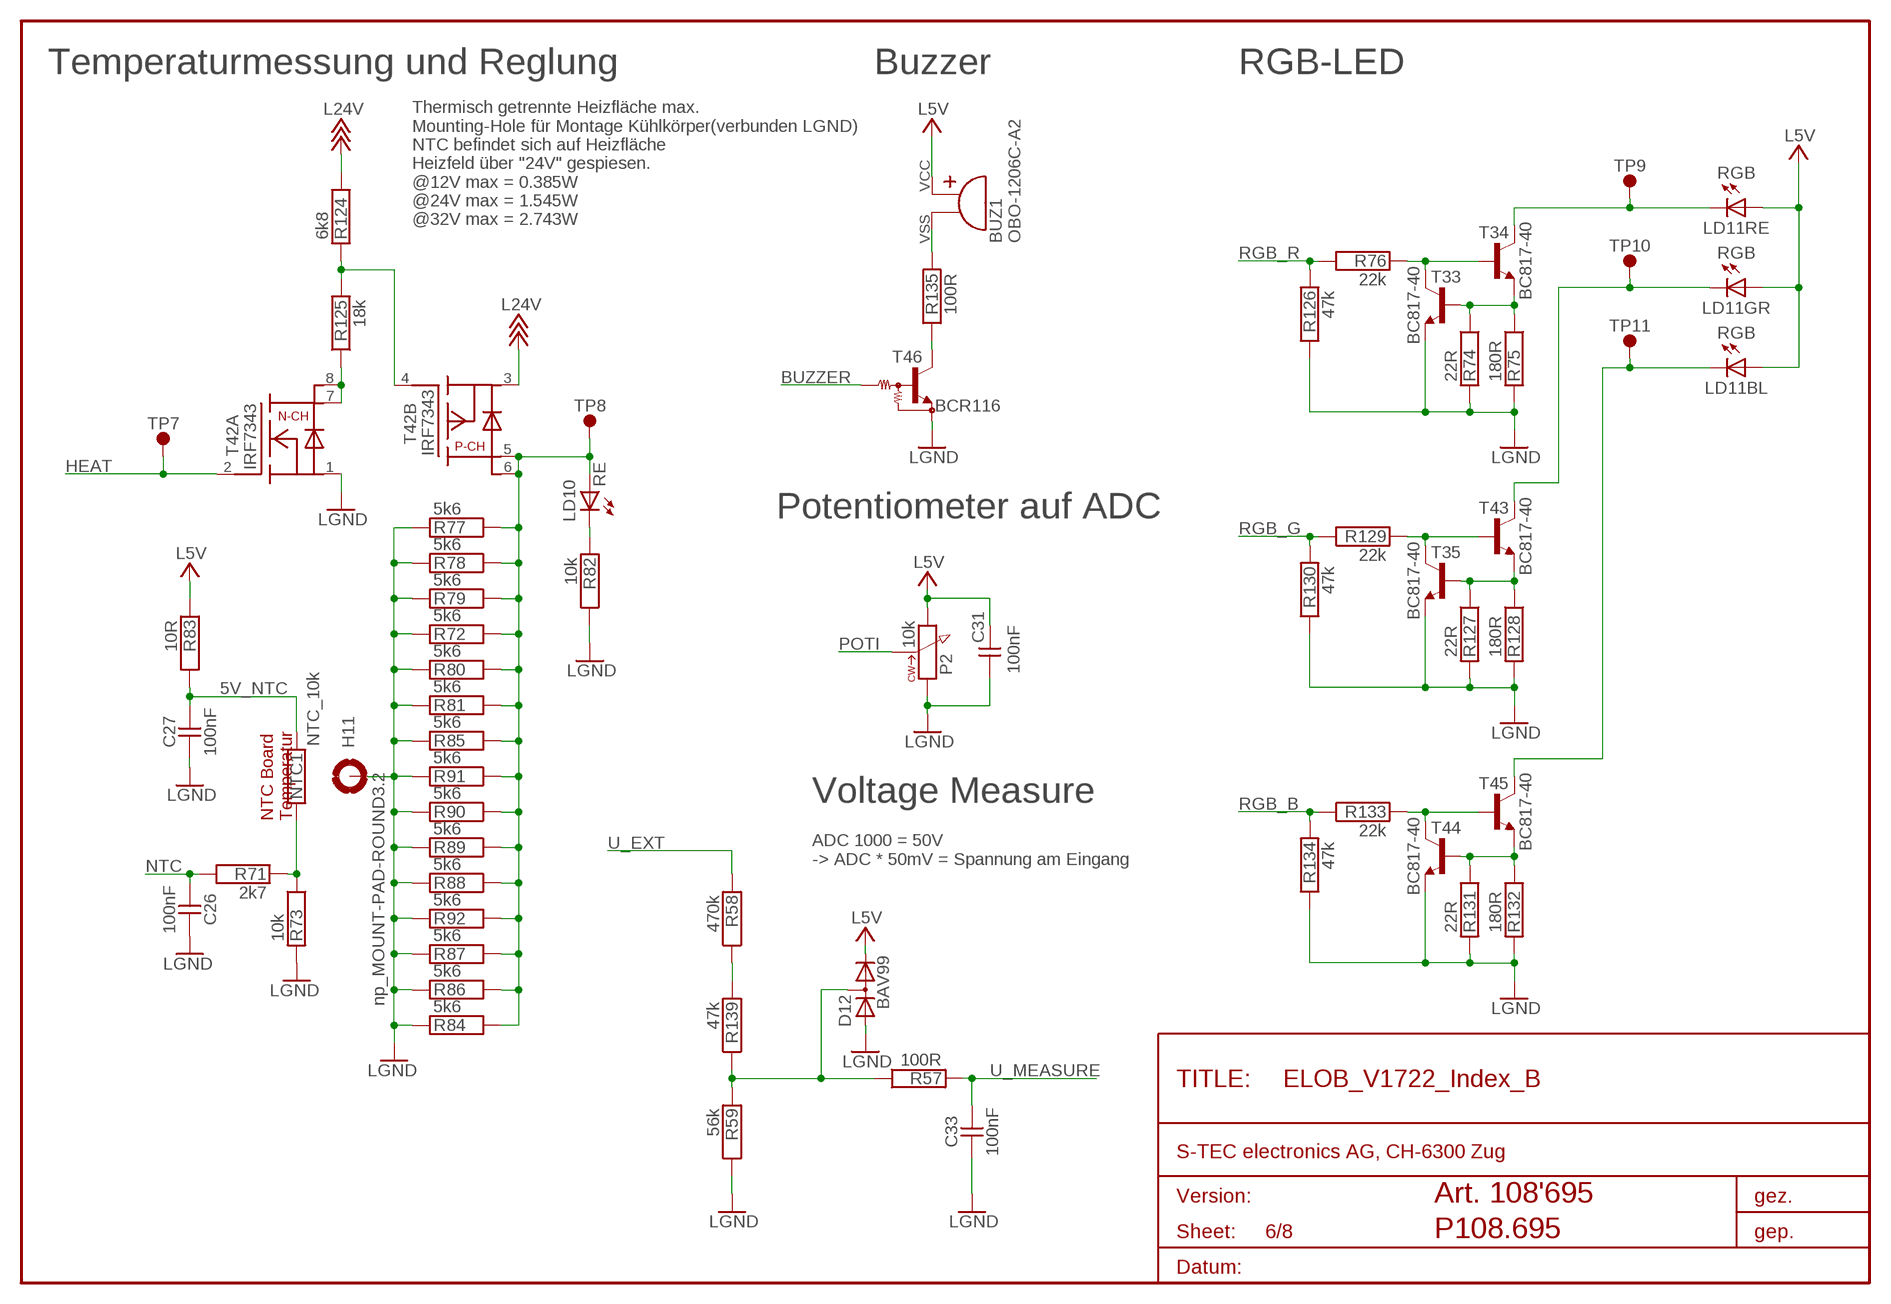
[diagram p5: schematic, sheet 6]

### Parts
BUZ1  OBO-1206C-A2  BUZZER_OBO_OBO-12XX  [BUZ_TCW12]
C26  100nF  C_SMD0603  [C0603]
C27  100nF  C_SMD0603  [C0603]
C31  100nF  C_SMD0603  [C0603]
C33  100nF  C_SMD0603  [C0603]
D12  BAV99  DIODE_DUAL_CAC_BAV99  [SOT_23]
H11  np_MOUNT-PAD-ROUND3.2  MOUNT-PAD-ROUND3.2  [3,2-PAD]
LD10  RE  LED_0805  [LED_0805]
LD11  RGB  LED_RGB_HARVATEK_HT-U3A8  [LED_HARVATEK_HT-U3A8]
NTC1  NTC_10k  R1206  [R1206]
P2  10k  POTI_PIHER_PTC-15  [POTI_PIHER_PTC-15]
R57  100R  R0603  [R0603]
R58  470k  R1206  [R1206]
R59  56k  R1206  [R1206]
R71  2k7  R0603  [R0603]
R72  5k6  R1206  [R1206]
R73  10k  R0603  [R0603]
R74  22R  R0603  [R0603]
R75  180R  R0603  [R0603]
R76  22k  R0603  [R0603]
R77  5k6  R1206  [R1206]
R78  5k6  R1206  [R1206]
R79  5k6  R1206  [R1206]
R80  5k6  R1206  [R1206]
R81  5k6  R1206  [R1206]
R82  10k  R0603  [R0603]
R83  10R  R0603  [R0603]
R84  5k6  R1206  [R1206]
R85  5k6  R1206  [R1206]
R86  5k6  R1206  [R1206]
R87  5k6  R1206  [R1206]
R88  5k6  R1206  [R1206]
R89  5k6  R1206  [R1206]
R90  5k6  R1206  [R1206]
R91  5k6  R1206  [R1206]
R92  5k6  R1206  [R1206]
R124  6k8  R0603  [R0603]
R125  18k  R0603  [R0603]
R126  47k  R0603  [R0603]
R127  22R  R0603  [R0603]
R128  180R  R0603  [R0603]
R129  22k  R0603  [R0603]
R130  47k  R0603  [R0603]
R131  22R  R0603  [R0603]
R132  180R  R0603  [R0603]
R133  22k  R0603  [R0603]
R134  47k  R0603  [R0603]
R135  100R  R1206  [R1206]
R139  47k  R1206  [R1206]
T33  BC817-40  TRANSISTOR_NPN_BC817  [SOT23-BEC]
T34  BC817-40  TRANSISTOR_NPN_BC817  [SOT23-BEC]
T35  BC817-40  TRANSISTOR_NPN_BC817  [SOT23-BEC]
T42  IRF7343  FET_N+P-CHANNEL_IRF7343_SO-8  [SO-8_FET]
T43  BC817-40  TRANSISTOR_NPN_BC817  [SOT23-BEC]
T44  BC817-40  TRANSISTOR_NPN_BC817  [SOT23-BEC]
T45  BC817-40  TRANSISTOR_NPN_BC817  [SOT23-BEC]
T46  BCR116  TRANSISTOR_NPN_RESISTOR_BCR116  [SOT_23]
TP2  TP8  TESTPAD_1P_1MM  [ANSCHLUSSPAD_1MM]
TP3  TP10  TESTPAD_1P_1MM  [ANSCHLUSSPAD_1MM]
TP5  TP9  TESTPAD_1P_1MM  [ANSCHLUSSPAD_1MM]
TP6  TP11  TESTPAD_1P_1MM  [ANSCHLUSSPAD_1MM]
TP13  TP7  TESTPAD_1P_1MM  [ANSCHLUSSPAD_1MM]

### Nets
5V_NTC: C27.1 NTC1.2 R83.2
BUZZER: T46.1(B) ; also sheet 1
HEAT: T42.2(A:G) TP13.1 ; also sheet 1
L5V: BUZ1.VCC(+) C31.1 D12.2(C) LD11.1(RE:A) LD11.2(GR:A) LD11.3(BL:A) P2.E R83.1 ; supply symbol labelled .L5V ; also sheet 1,2,3,4,5,7,8
L24V: R124.2 T42.3(B:S) ; supply symbol labelled .L24V ; also sheet 4,7,8
LGND: C26.2 C27.2 C31.2 C33.2 D12.1(A) H11.B3,2(MOUNT) P2.A R59.2 R72.1 R73.1 R74.1 R75.1 R77.1 R78.1 R79.1 R80.1 R81.1 R82.2 R84.1 R85.1 R86.1 R87.1 R88.1 R89.1 R90.1 R91.1 R92.1 R126.2 R127.1 R128.1 R130.2 R131.1 R132.1 R134.2 T33.2(E) T35.2(E) T42.1(A:S) T44.2(E) T46.2(E) ; supply symbol labelled .LGND ; also sheet 1,2,3,4,5,7,8
N$7: R58.2 R139.1
N$33: R76.1 T33.3(C) T34.1(B)
N$34: R74.2 R75.2 T33.1(B) T34.2(E)
N$35: R129.1 T35.3(C) T43.1(B)
N$36: R127.2 R128.2 T35.1(B) T43.2(E)
N$37: R133.1 T44.3(C) T45.1(B)
N$38: R131.2 R132.2 T44.1(B) T45.2(E)
N$66: NTC1.1 R71.1 R73.2
N$87: D12.3(AC) R57.2 R59.1 R139.2
N$101: LD10.K(C) R82.1
N$145: LD10.A R72.2 R77.2 R78.2 R79.2 R80.2 R81.2 R84.2 R85.2 R86.2 R87.2 R88.2 R89.2 R90.2 R91.2 R92.2 T42.5(B:D1) T42.6(B:D2) TP2.1
N$146: R125.2 T42.7(A:D1) T42.8(A:D2)
N$147: R124.1 R125.1 T42.4(B:G)
N$149: LD11.4(BL:C) T45.3(C) TP6.1
N$150: LD11.5(GR:C) T43.3(C) TP3.1
N$151: LD11.6(RE:C) T34.3(C) TP5.1
N$154: BUZ1.VSS(-) R135.1
N$155: R135.2 T46.3(C)
NTC: C26.1 R71.2 ; also sheet 1
POTI: P2.S ; also sheet 1
RGB_B: R133.2 R134.1 ; also sheet 1
RGB_G: R129.2 R130.1 ; also sheet 1
RGB_R: R76.2 R126.1 ; also sheet 1
U_EXT: R58.1 ; also sheet 8
U_MEASURE: C33.1 R57.1 ; also sheet 1

### Notes on the sheet
- Temperaturmessung und Reglung | Buzzer | RGB-LED
- Thermisch getrennte Heizfläche max.
  Mounting-Hole für Montage Kühlkörper(verbunden LGND)
  NTC befindet sich auf Heizfläche
  Heizfeld über "24V" gespiesen.
  @12V max = 0.385W
  @24V max = 1.545W
  @32V max = 2.743W
- Potentiometer auf ADC
- Voltage Measure
- NTC Board
  Temperatur
- ADC 1000 = 50V
  -> ADC * 50mV = Spannung am Eingang
- Art. 108'695
- P108.695

## Sheet 7 of 8: LCD, I2C & RS485
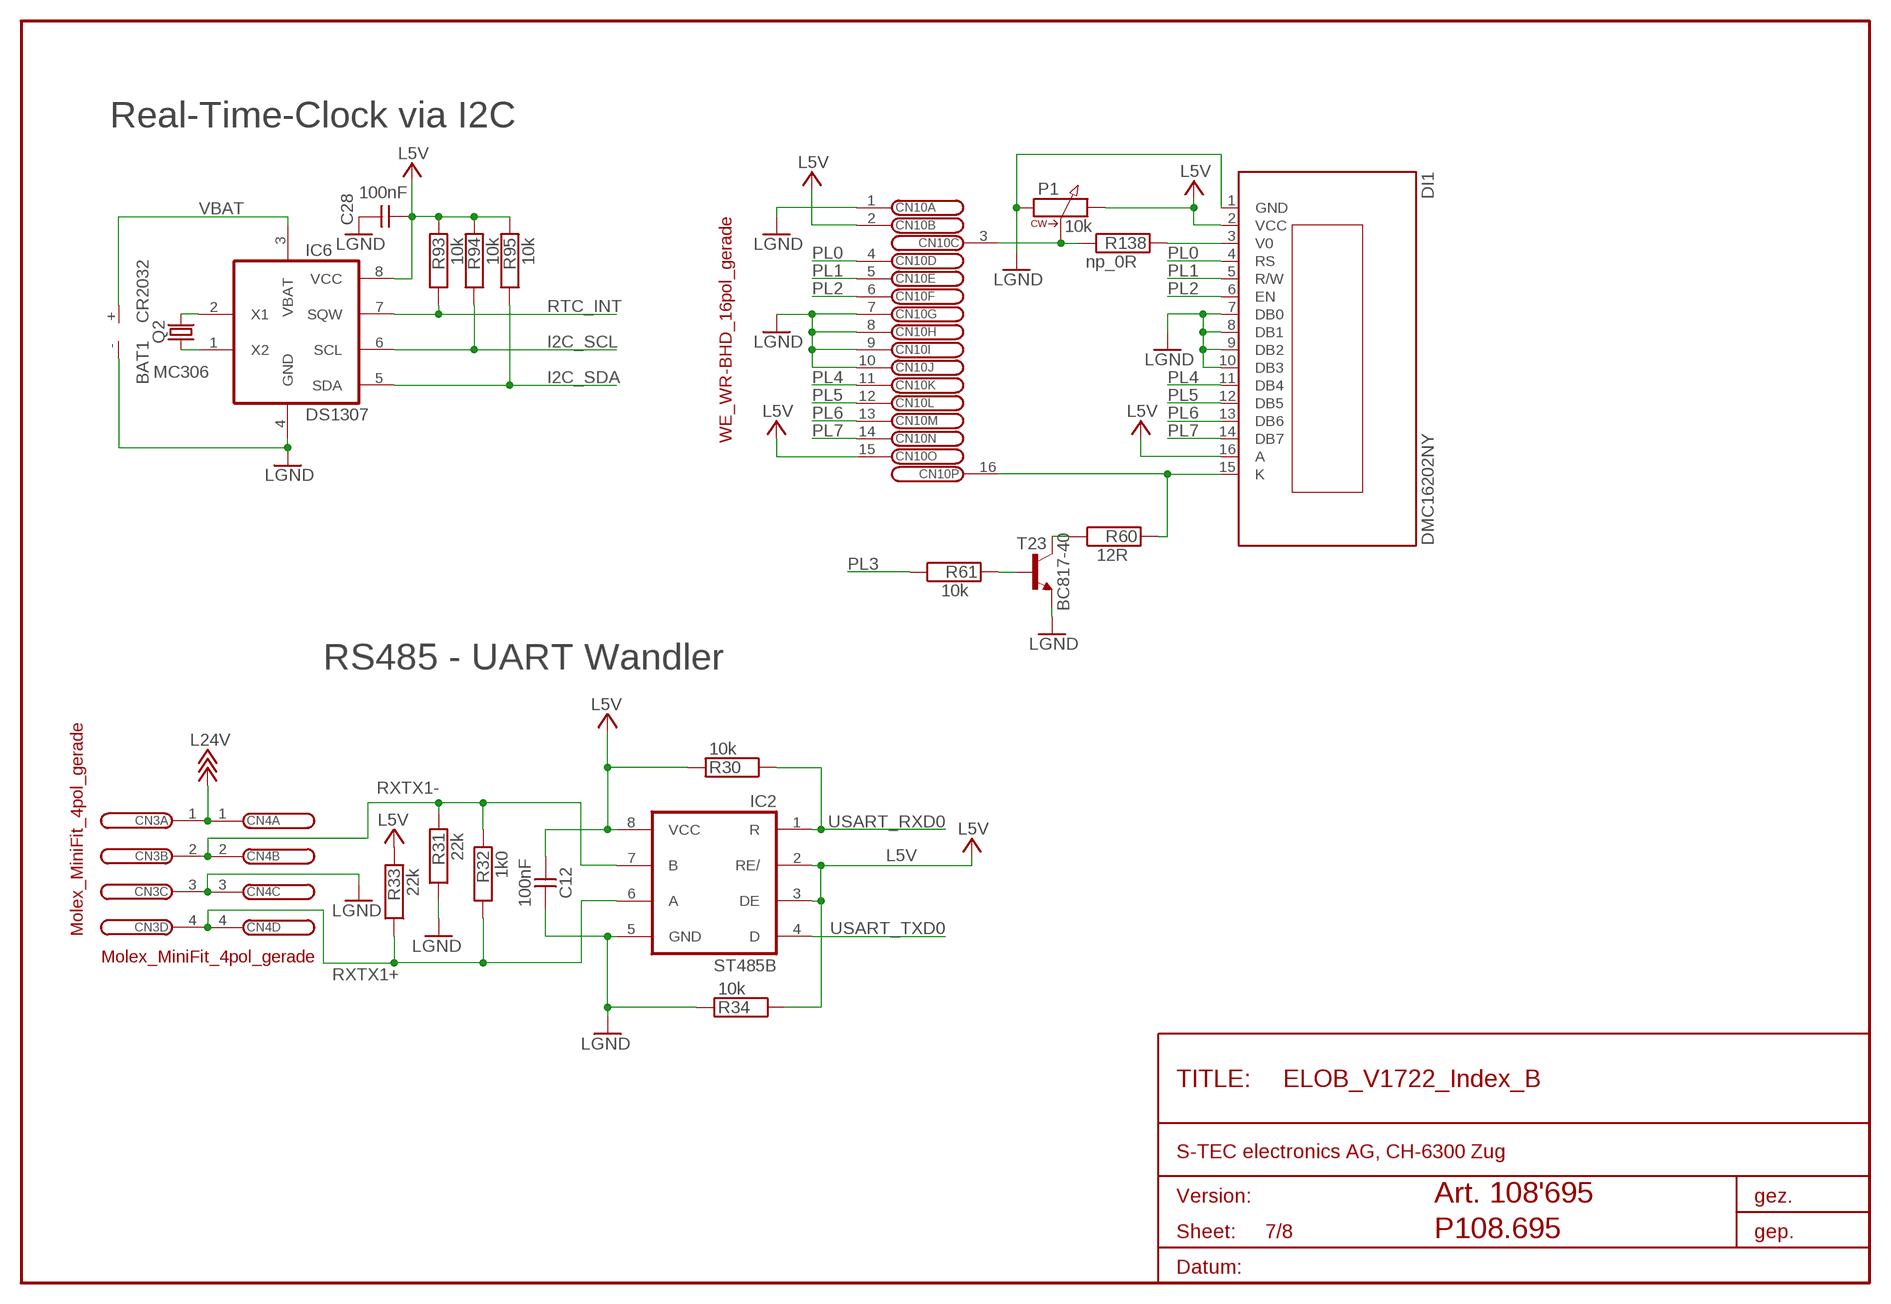
[diagram p6: schematic, sheet 7]

### Parts
BAT1  CR2032  BATTERYHOLDER_CR2032SMT_WÜRTH  [CR2032SMT_WÜRTH]
C12  100nF  C_SMD0603  [C0603]
C28  100nF  C_SMD0603  [C0603]
CN3  Molex_MiniFit_4pol_gerade  CONNECTOR_4-POL_MOLEX_MINIFIT_G  [MOLEX_MINIFIT_4G]
CN4  Molex_MiniFit_4pol_gerade  CONNECTOR_4-POL_MOLEX_MINIFIT_G  [MOLEX_MINIFIT_4G]
CN10  WE_WR-BHD_16pol_gerade  CONNECTOR_16-POL_WE_WR-BHD_G  [BH_16G]
DI1  DMC16202NY  DISPLAY_DMC16202NY-LY-AZE-BJN  [DISPLAY_DMC16202NY-LY-AZE-BJN]
IC2  ST485B  SN75HVD3082ED  [SO_08]
IC6  DS1307  [SO_08]
P1  10k  POTI_MURATA_PVG3A  [POTI_MURATA_PVG3A]
Q2  MC306  CRYSTAL_MC306  [MC306]
R30  10k  R0603  [R0603]
R31  22k  R0603  [R0603]
R32  1k0  R0603  [R0603]
R33  22k  R0603  [R0603]
R34  10k  R0603  [R0603]
R60  12R  R0603  [R0603]
R61  10k  R0603  [R0603]
R93  10k  R0603  [R0603]
R94  10k  R0603  [R0603]
R95  10k  R0603  [R0603]
R138  np_0R  R1206  [R1206]
T23  BC817-40  TRANSISTOR_NPN_BC817  [SOT23-BEC]

### Nets
I2C_SCL: IC6.6(SCL) R94.2 ; also sheet 1,5
I2C_SDA: IC6.5(SDA) R95.2 ; also sheet 1,5
L5V: C12.1 C28.2 CN10.2 CN10.15 DI1.2(VCC) DI1.16(A) IC2.2(RE/) IC2.3(DE) IC2.8(VCC) IC6.8(VCC) P1.3 R30.1 R33.1 R34.2 R93.1 R94.1 R95.1 ; supply symbol labelled .L5V ; also sheet 1,2,3,4,5,6,8
L24V: CN3.1 CN4.1 ; supply symbol labelled .L24V ; also sheet 4,6,8
LGND: BAT1.- C12.2 C28.1 CN3.3 CN4.3 CN10.1 CN10.7 CN10.8 CN10.9 CN10.10 DI1.1(GND) DI1.7(DB0) DI1.8(DB1) DI1.9(DB2) DI1.10(DB3) IC2.5(GND) IC6.4(GND) P1.1 R31.2 R34.1 T23.2(E) ; supply symbol labelled .LGND ; also sheet 1,2,3,4,5,6,8
N$28: CN10.3 P1.2(S) R138.2
N$64: CN10.16 DI1.15(K) R60.1
N$69: R61.1 T23.1(B)
N$85: IC6.1(X2) Q2.1
N$86: DI1.3(V0) R138.1
N$93: IC6.2(X1) Q2.4
N$111: R60.2 T23.3(C)
PL0: CN10.4 DI1.4(RS) ; also sheet 1
PL1: CN10.5 DI1.5(R/W) ; also sheet 1
PL2: CN10.6 DI1.6(EN) ; also sheet 1
PL3: R61.2 ; also sheet 1
PL4: CN10.11 DI1.11(DB4) ; also sheet 1
PL5: CN10.12 DI1.12(DB5) ; also sheet 1
PL6: CN10.13 DI1.13(DB6) ; also sheet 1
PL7: CN10.14 DI1.14(DB7) ; also sheet 1
RTC_INT: IC6.7(SQW) R93.2 ; also sheet 1
RXTX1+: CN3.4 CN4.4 IC2.6(A) R32.2 R33.2
RXTX1-: CN3.2 CN4.2 IC2.7(B) R31.1 R32.1
USART_RXD0: IC2.1(R) R30.2 ; also sheet 1
USART_TXD0: IC2.4(D) ; also sheet 1
VBAT: BAT1.+ IC6.3(VBAT)

### Notes on the sheet
- Real-Time-Clock via I2C
- RS485 - UART Wandler
- Art. 108'695
- P108.695

## Sheet 8 of 8: Speisung & USB
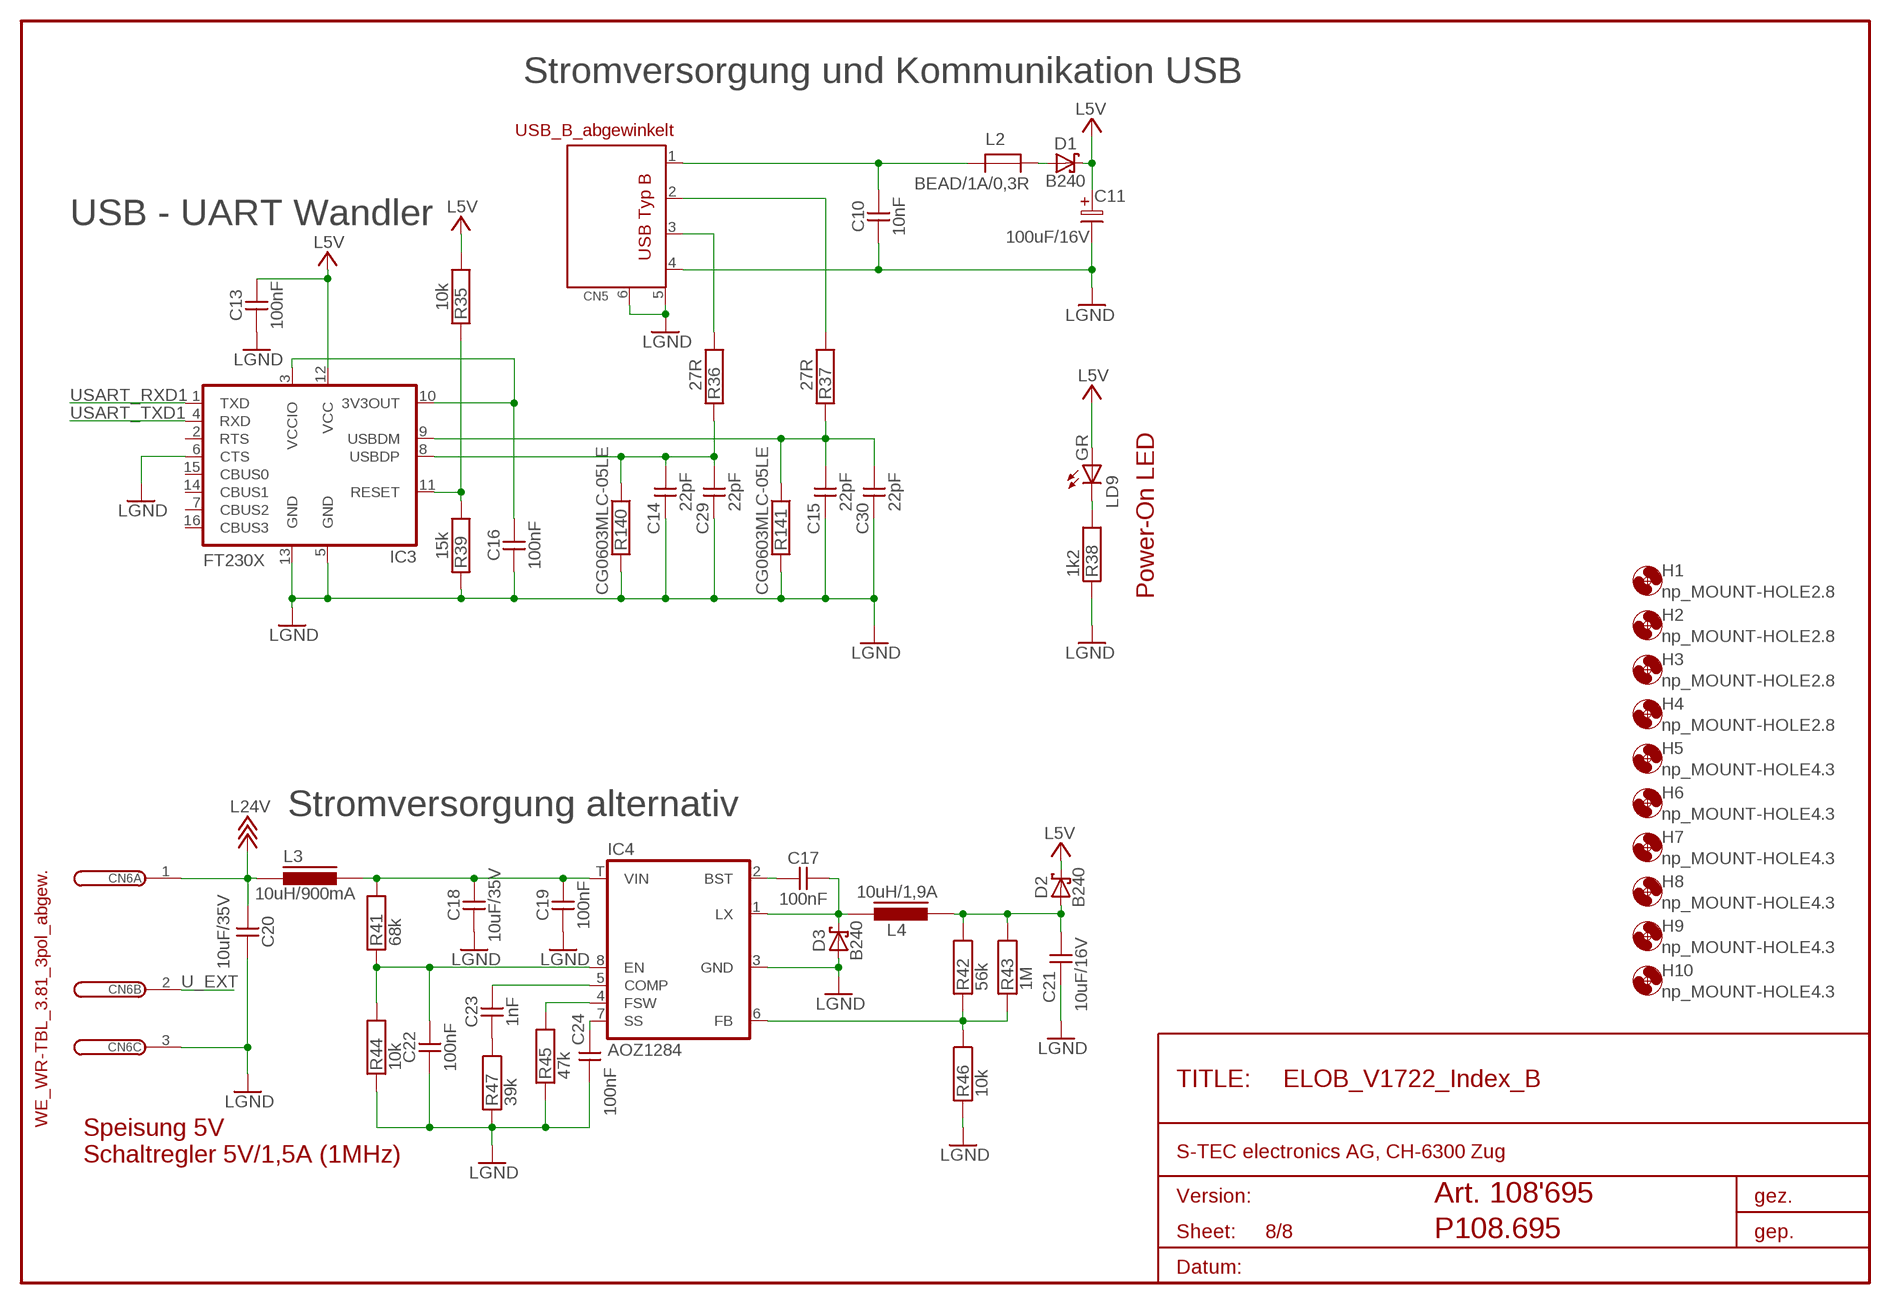
[diagram p7: schematic, sheet 8]

### Parts
C10  10nF  C_SMD0603  [C0603]
C11  100uF/16V  C-POL_SMD_6,3  [ELKO_SMD_6.3]
C13  100nF  C_SMD0603  [C0603]
C14  22pF  C_SMD0603  [C0603]
C15  22pF  C_SMD0603  [C0603]
C16  100nF  C_SMD0603  [C0603]
C17  100nF  C_SMD0603  [C0603]
C18  10uF/35V  C_SMD1206  [C1206]
C19  100nF  C_SMD0603  [C0603]
C20  10uF/35V  C_SMD1206  [C1206]
C21  10uF/16V  C_SMD1206  [C1206]
C22  100nF  C_SMD0603  [C0603]
C23  1nF  C_SMD0603  [C0603]
C24  100nF  C_SMD0603  [C0603]
C29  22pF  C_SMD0603  [C0603]
C30  22pF  C_SMD0603  [C0603]
CN5  USB_B_abgewinkelt  USB-B  [USB-B]
CN6  WE_WR-TBL_3.81_3pol_abgew.  CONNECTOR_3-POL_WE_WR-TBL_3,81MM_A  [PHOENIX_G381_3]
D1  B240  DIODE_SCHOTTKY_SMA  [SMA]
D2  B240  DIODE_SCHOTTKY_SMA  [SMA]
D3  B240  DIODE_SCHOTTKY_SMA  [SMA]
H1  np_MOUNT-HOLE2.8  MOUNT-HOLE2.8  [2,8]
H2  np_MOUNT-HOLE2.8  MOUNT-HOLE2.8  [2,8]
H3  np_MOUNT-HOLE2.8  MOUNT-HOLE2.8  [2,8]
H4  np_MOUNT-HOLE2.8  MOUNT-HOLE2.8  [2,8]
H5  np_MOUNT-HOLE4.3  MOUNT-HOLE4.3  [4,3]
H6  np_MOUNT-HOLE4.3  MOUNT-HOLE4.3  [4,3]
H7  np_MOUNT-HOLE4.3  MOUNT-HOLE4.3  [4,3]
H8  np_MOUNT-HOLE4.3  MOUNT-HOLE4.3  [4,3]
H9  np_MOUNT-HOLE4.3  MOUNT-HOLE4.3  [4,3]
H10  np_MOUNT-HOLE4.3  MOUNT-HOLE4.3  [4,3]
IC3  FT230X  FT230XSSOP16  [SSOP16]
IC4  AOZ1284  IC_AOZ1284_SO-8_EP  [SO-8_EP_AOS]
L2  BEAD/1A/0,3R  FERRITE-BEAD_1206  [R1206]
L3  10uH/900mA  INDUCTOR_FILTER_L1210  [L1210]
L4  10uH/1,9A  INDUCTOR_FILTER_NR6028  [INDUCTOR_NR6028]
LD9  GR  LED_0805  [LED_0805]
R35  10k  R0603  [R0603]
R36  27R  R0603  [R0603]
R37  27R  R0603  [R0603]
R38  1k2  R0603  [R0603]
R39  15k  R0603  [R0603]
R41  68k  R0603  [R0603]
R42  56k  R0603  [R0603]
R43  1M  R0603  [R0603]
R44  10k  R0603  [R0603]
R45  47k  R0603  [R0603]
R46  10k  R0603  [R0603]
R47  39k  R0603  [R0603]
R140  CG0603MLC-05LE  R0603  [R0603]
R141  CG0603MLC-05LE  R0603  [R0603]

### Nets
L5V: C11.P C13.1 D1.C D2.C IC3.12(VCC) LD9.A R35.2 ; supply symbol labelled .L5V ; also sheet 1,2,3,4,5,6,7
L24V: C20.1 CN6.1 L3.1 ; supply symbol labelled .L24V ; also sheet 4,6,7
LGND: C10.2 C11.M C13.2 C14.2 C15.2 C16.2 C18.2 C19.2 C20.2 C21.2 C22.2 C24.2 C29.2 C30.2 CN5.4 CN5.5 CN5.6 CN6.3 D3.A IC3.5(GND) IC3.6(CTS) IC3.13(GND) IC4.3(GND) R38.1 R39.1 R44.1 R45.1 R46.1 R47.1 R140.1 R141.1 ; supply symbol labelled .LGND ; also sheet 1,2,3,4,5,6,7
N$4: C17.2 D3.C IC4.1(LX) L4.1
N$5: C24.1 IC4.7(SS)
N$11: D1.A L2.2
N$39: IC4.4(FSW) R45.2
N$40: C23.1 IC4.5(COMP)
N$41: C23.2 R47.2
N$42: C18.1 C19.1 IC4.T(VIN) L3.2 R41.2
N$43: C22.1 IC4.8(EN) R41.1 R44.2
N$44: IC4.6(FB) R42.1 R43.1 R46.2
N$45: C17.1 IC4.2(BST)
N$46: C21.1 D2.A L4.2 R42.2 R43.2
N$48: IC3.11(RESET) R35.1 R39.2
N$49: LD9.K(C) R38.2
N$60: C10.1 CN5.1 L2.1
N$61: C15.1 C30.1 IC3.9(USBDM) R37.1 R141.2
N$62: CN5.2 R37.2
N$78: C14.1 C29.1 IC3.8(USBDP) R36.1 R140.2
N$79: C16.1 IC3.3(VCCIO) IC3.10(3V3OUT)
N$80: CN5.3 R36.2
U_EXT: CN6.2 ; also sheet 6
USART_RXD1: IC3.1(TXD) ; also sheet 1
USART_TXD1: IC3.4(RXD) ; also sheet 1
Unconnected: IC3.2(RTS) IC3.7(CBUS2) IC3.14(CBUS1) IC3.15(CBUS0) IC3.16(CBUS3)

### Notes on the sheet
- Stromversorgung und Kommunikation USB
- USB - UART Wandler
- Power-On LED
- Stromversorgung alternativ
- Speisung 5V
- Schaltregler 5V/1,5A (1MHz)
- Art. 108'695
- P108.695

## Library data of the parts
.L5V TP1 TP12 = _furrer:TESTPAD_2P
BAT1 = _furrer:BATTERYHOLDER
BC = _furrer:BARCODE
BUZ1 = _furrer:BUZZER
C1-C10 C12-C33 = _furrer:C
C11 = _furrer:C-POL
CN1 = _DoIt:CONNECTOR_10POL
CN2 CN9 CN13 = _furrer:CONNECTOR_10-POL
CN3 CN4 CN7 = _furrer:CONNECTOR_4-POL
CN5 = _DoIt:USB-B
CN6 = _furrer:CONNECTOR_3-POL
CN8 CN11 = _furrer:CONNECTOR_8-POL
CN10 = _furrer:CONNECTOR_16-POL
CN12 = _furrer:CONNECTOR_7-POL
D1-D3 D10 D11 = _furrer:DIODE_SCHOTTKY
D4-D9 D12 D14-D25 = _furrer:DIODE_DUAL_CAC
DI1 = _furrer:DISPLAY_DMC16202NY-LY-AZE-BJN
H1-H10 = holes:MOUNT-HOLE: MOUNTING HOLE with drill center marker
H11 = holes:MOUNT-PAD-ROUND: MOUNTING PAD, round
IC1 = _DoIt:ATMEGA2560
IC2 = s_tec:SN75HVD3082ED
IC3 = _DoIt:FT230X
IC4 = _furrer:IC_AOZ1284
IC5 = _furrer:IC_74*138
IC6 = s_tec:DS1307
IC7 = _furrer:IC_74*14
L1 L2 = _furrer:FERRITE-BEAD
L3 L4 = _furrer:INDUCTOR_FILTER
LD0 LD1-LD7 LD9 LD10 = _furrer:LED
LD11 = _furrer:LED_RGB
NTC1 R1-R141 = _furrer:R
OC1-OC3 = _furrer:OPTOCOUPLER
P1 P2 = _furrer:POTI
Q1 = s_tec_rene:CRYSTAL
Q2 = _furrer:CRYSTAL
REF1-REF3 = _furrer:REF
RESET TA0 TA1-TA7 TB0 TB1-TB11 = _furrer:TASTER
S0 S1-S7 = switch-ck:JS202011SCQN: DPDT SLIDE SWITCH
SEG1 = _DoIt:4-FACH_7-SEGMENT
T1-T8 T24-T32 T37 T46 = _furrer:TRANSISTOR_NPN_RESISTOR
T9-T14 T23 T33-T35 T43-T45 = _furrer:TRANSISTOR_NPN
T15 T16 = _furrer:FET_N-CHANNEL
T19-T22 = _furrer:TRANSISTOR_PNP_RESISTOR
T38-T41 = _furrer:TRANSISTOR_PNP
T42 = _furrer:FET_N+P-CHANNEL: Dual N and P Channel MOSFET
TP2-TP11 TP13 = _furrer:TESTPAD_1P

## Net classes
1 Power: clearance 0.5 mm
3 PWM_OC: width 0.15 mm, drill 0.3 mm, clearance 0.8 mm to class 0, clearance 0.8 mm to class 1, clearance 0.2 mm to class 2, clearance 0.2 mm